# EAGLE board Open-Controller-Unitary_V1 (EAGLE 9.1.0), part 1 of 3
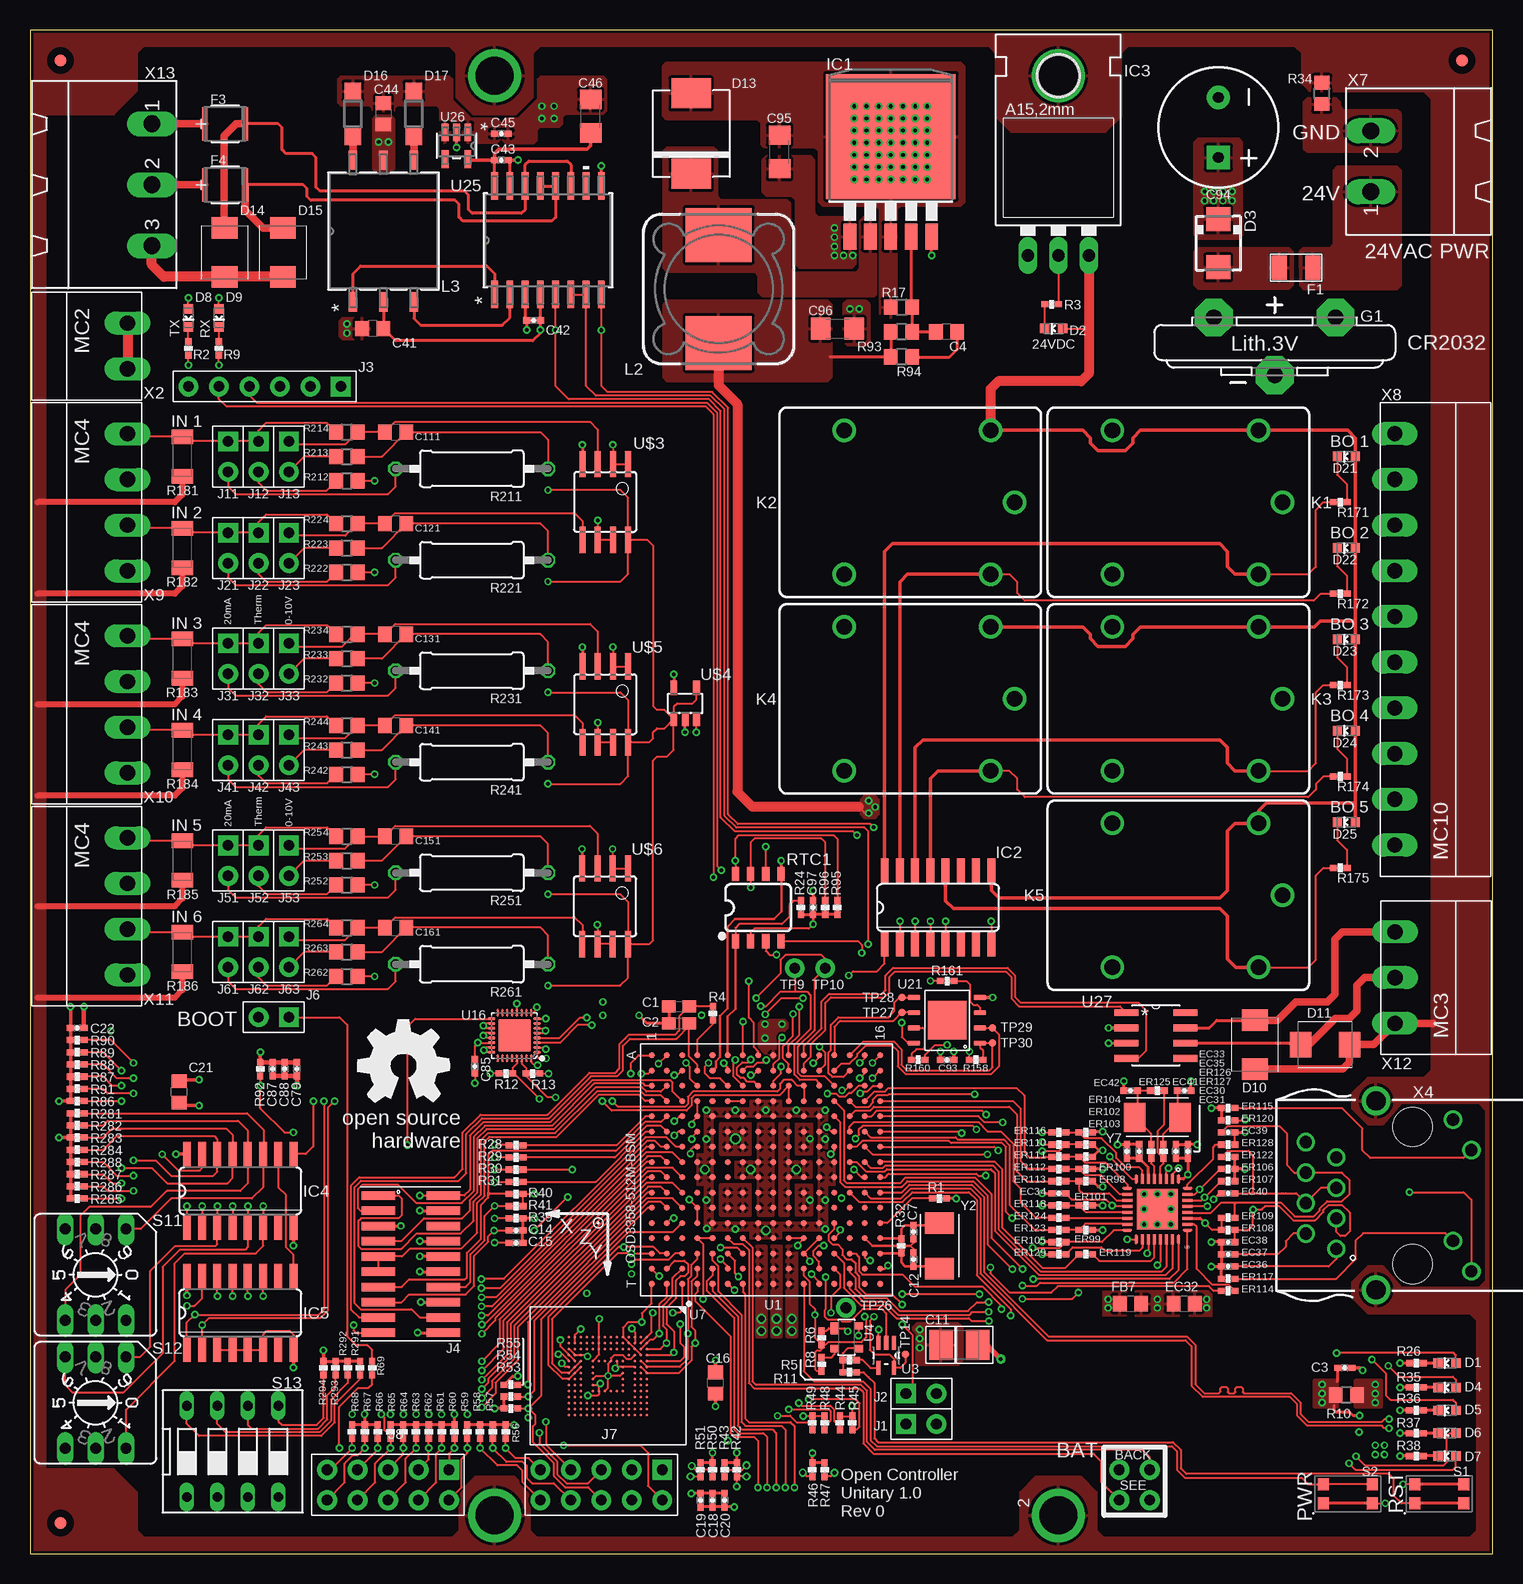
[diagram p7: board, top side]
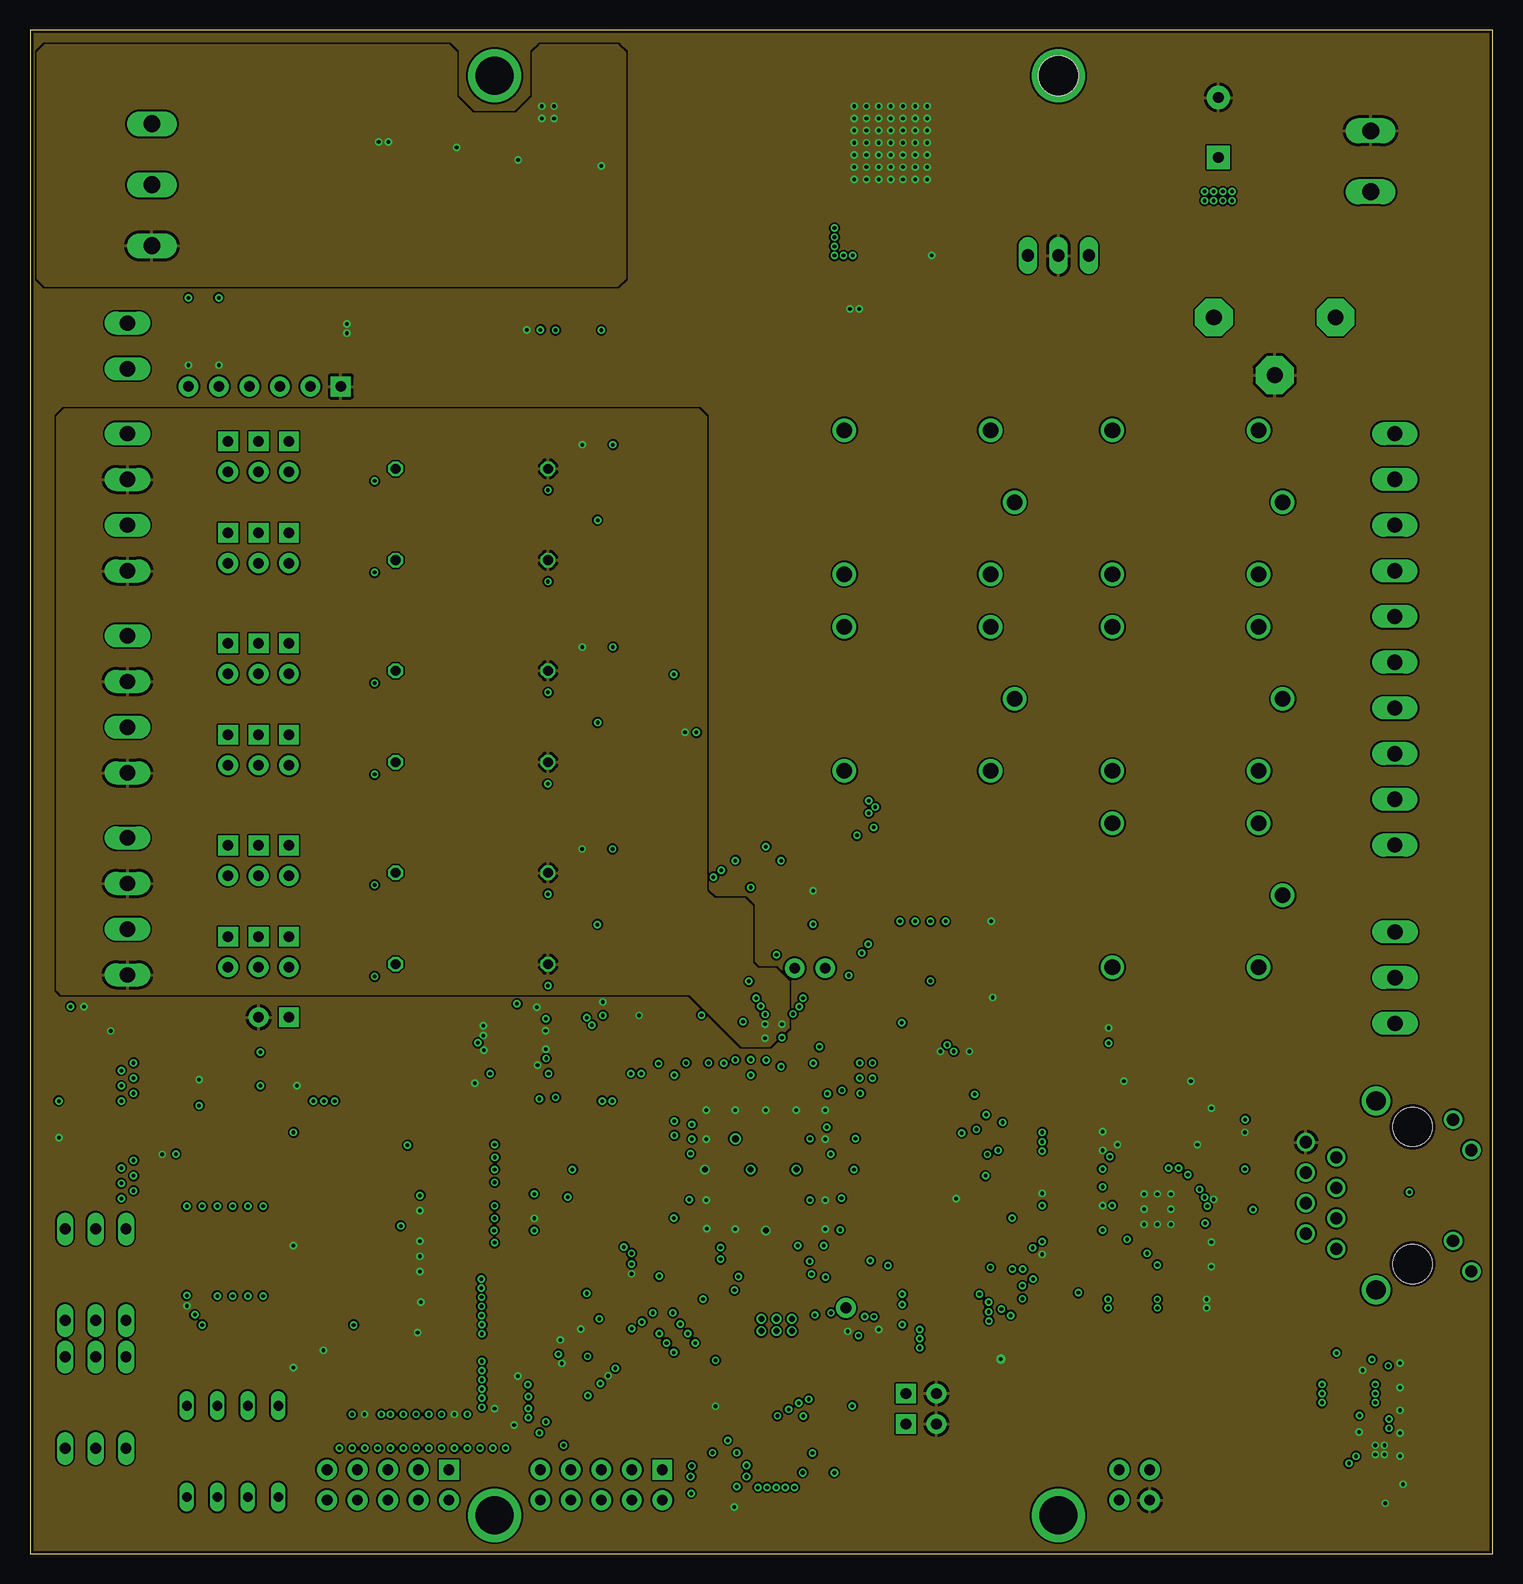
[diagram p8: board, inner layer Route2]
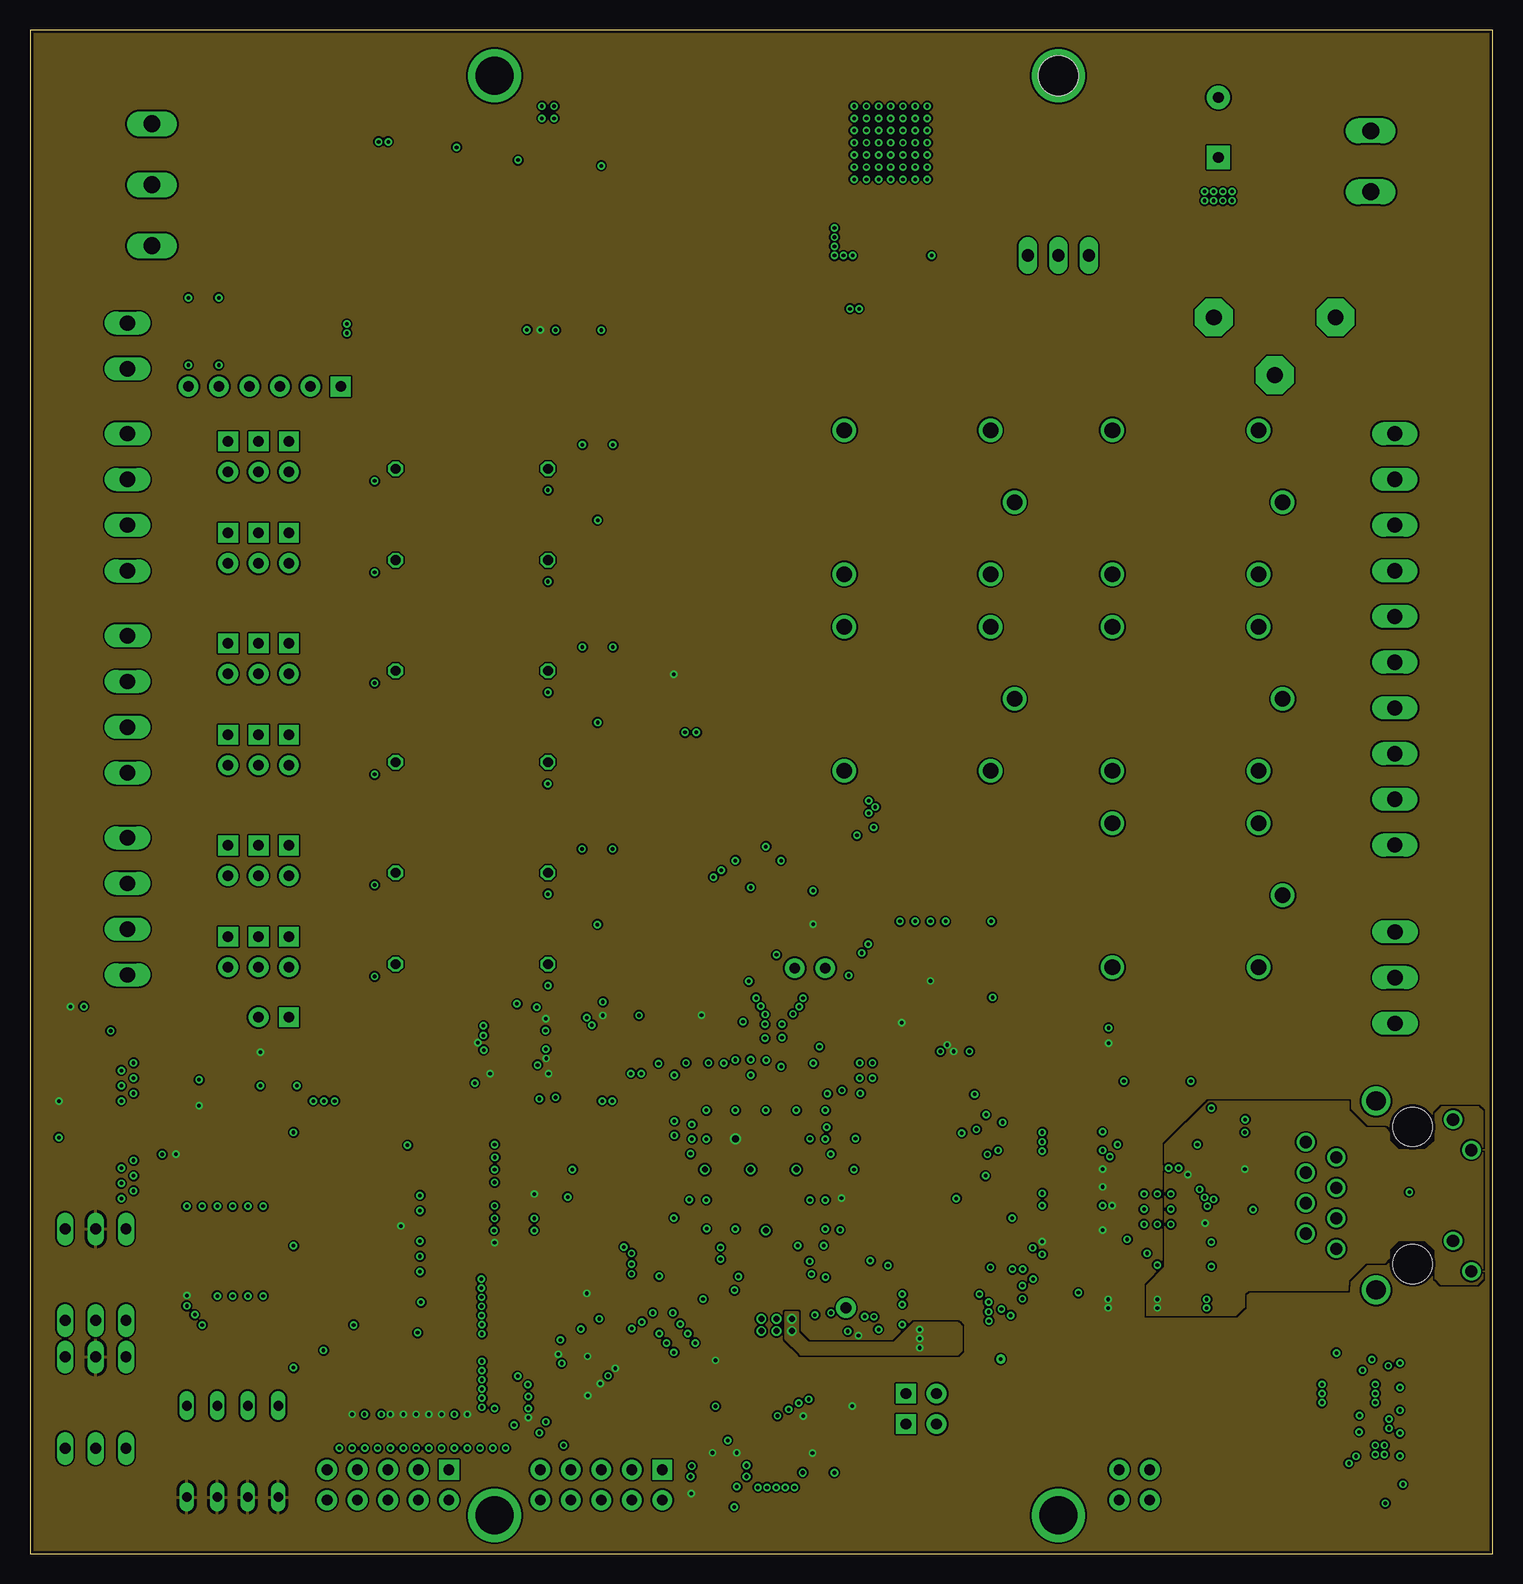
[diagram p9: board, inner layer Route15]
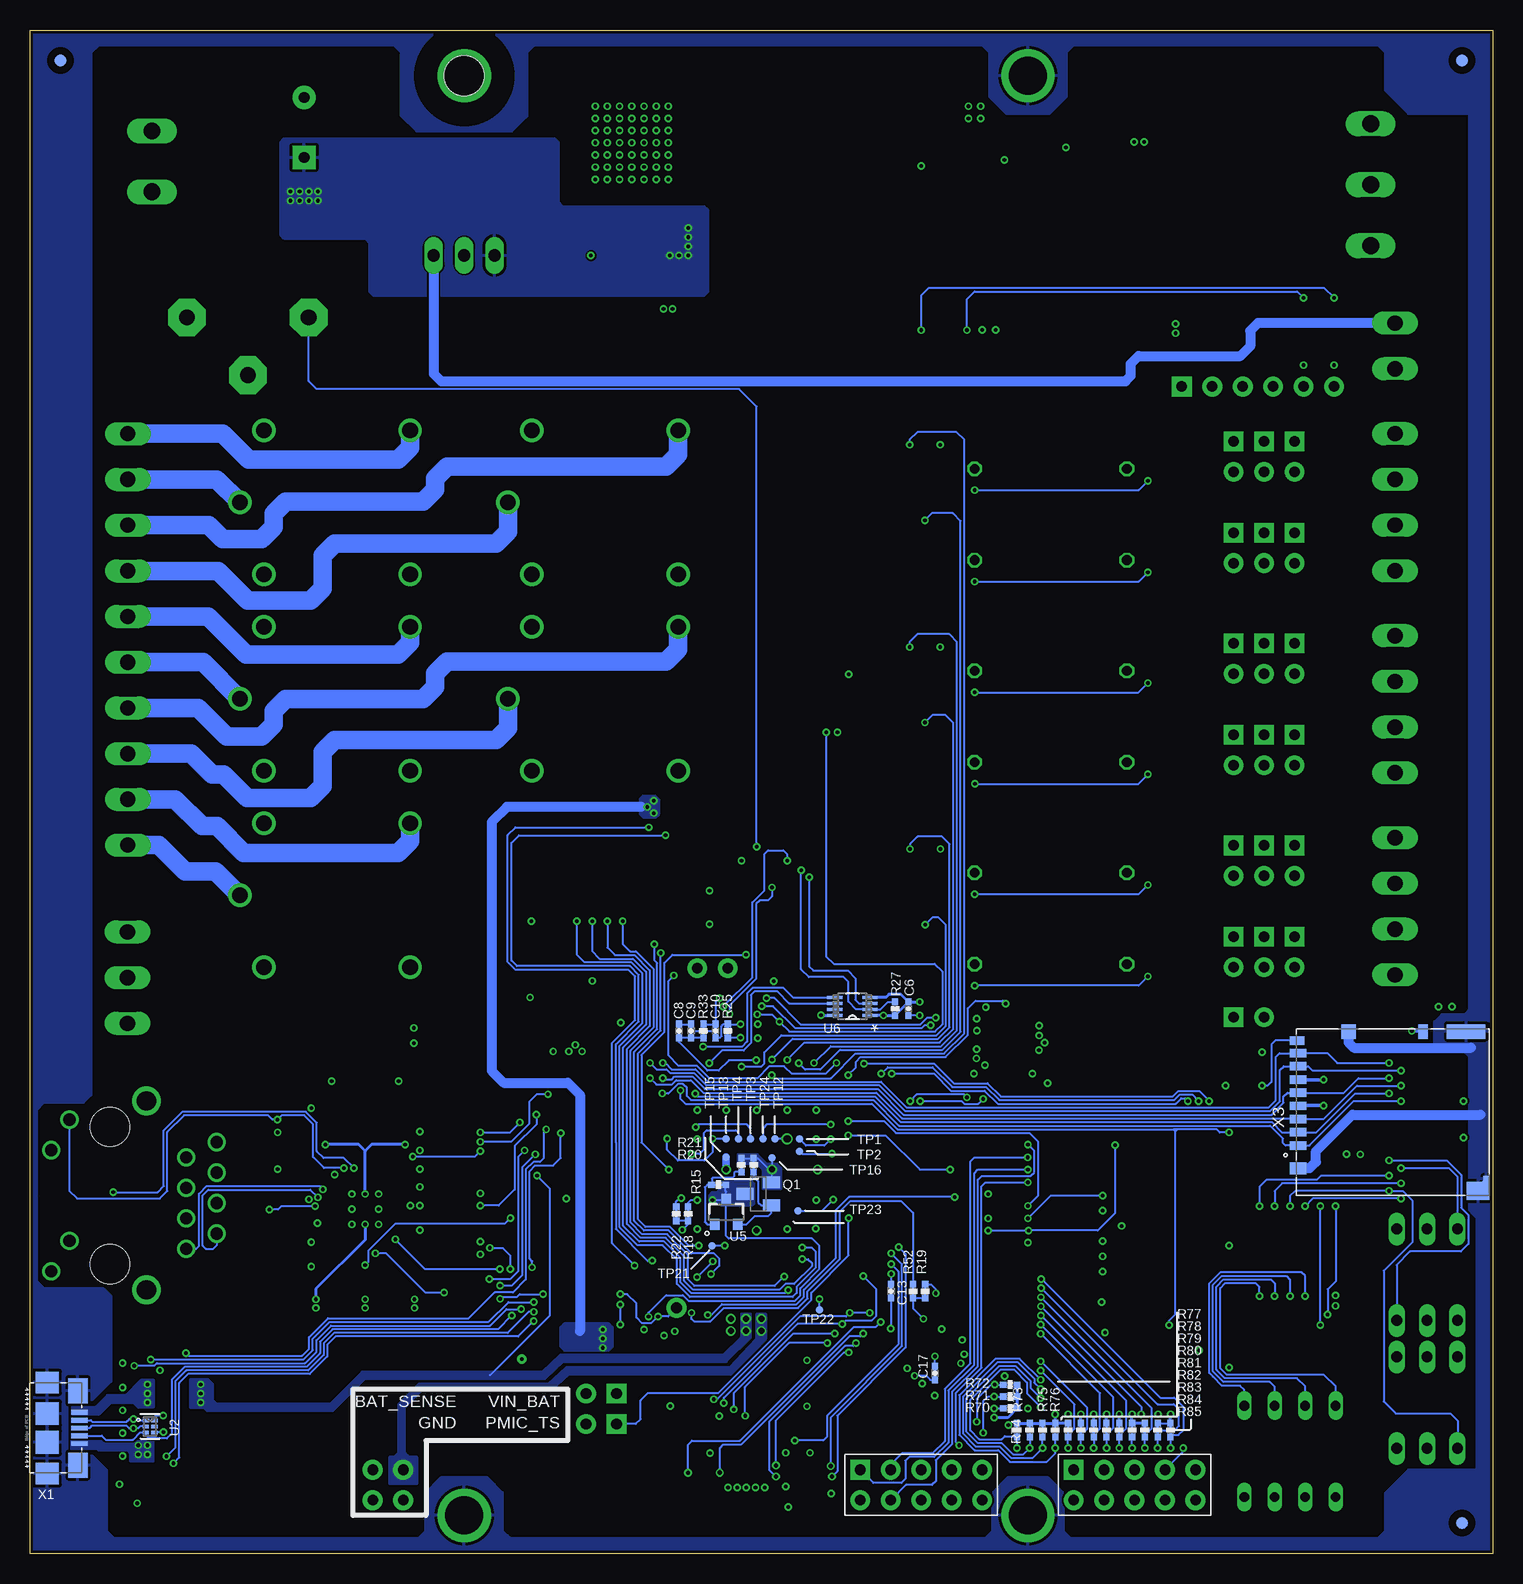
[diagram p10: board, bottom side, seen from below]

Size 121.92 x 127 mm. Coordinates in mm from the lower left corner, seen from the top.
Outline: 0,0 121.92,0 121.92,127 0,127 0,0
Copper layers (1*2*15*16): Top 0.035mm / dielectric 0.23mm / Route2 0.035mm / dielectric 0.93mm / Route15 0.035mm / dielectric 0.23mm / Bottom 0.035mm
Design rules "MF_Standard_4_Layer *": minimum track width 6mil, minimum drill 12mil, track to track 6mil, track to pad 6mil, pad to pad 6mil, via to via 6mil, smd to smd 0mil, copper to edge 10mil, drill to drill 10mil, minimum pad ring 6mil, minimum via ring 6mil, stop-mask expansion 2mil, vias tented up to drill 25mil, thermal gap 10mil
Net classes: 0 default: width 0.127 mm, drill 0.254 mm; 1 ground: width 0.152 mm, drill 0.254 mm, clearance 0.152 mm

## Footprints (pad centres in the part's own frame; a part is rotated, then mirrored left to right if it is on the bottom)
C0603 = smd 1.1 x 1: 1 -0.85,0; 2 0.85,0
C0402 = smd 0.61 x 0.508: 1 -0.559,0; 2 0.559,0
C0805 = smd 1.143 x 1.27: 1 -0.889,0; 2 0.889,0
B/3528-21R = smd 1.95 x 2.5: + 1.525,0; - -1.525,0
1206 = smd 1.6 x 1.8: 1 -1.4,0; 2 1.4,0
CPOL-RADIAL-5MM-10MM = drill 0.9 pad 1.93 square: + 2.5,0 | drill 0.9 pad 1.93: - -2.5,0
EIA-STD = smd 0.787 x 0.787: 1 -0.749,0; 2 0.749,0
SMA = smd 2 x 2: A 2,0; C -2,0
SMBJ = smd 1.78 x 2.16: A 2.04,0; C -2.03,0
SMC = smd 2.5 x 3.3: A 3.35,0; C -3.35,0
SOD123 = smd 1.4 x 1.4: A 1.9,0; C -1.9,0
R0402 = smd 0.61 x 0.508: 1 -0.559,0; 2 0.559,0
F1206W = smd 1.27 x 2.032: 1 -1.397,0; 2 1.397,0
FUS_MICROSMD010F_TYCO = smd 0.457 x 2.794: 1 -1.689,0; 2 1.689,0
FIDUCIAL_40MIL = smd 1.016 x 1.016: P$1 0,0
CR2032V = drill 1.321 pad 3.15 octagon: + -2.54,-5.08; +@1 -2.54,5.08; - 2.286,0
TO263-5 = smd 1.067 x 2.159: 1 -3.404,-5.791; 2 -1.702,-5.791; 3 0,-5.791; 4 1.702,-5.791; 5 3.404,-5.791 | smd 10.8 x 10.41: 6 0,2.54
SO16 = smd 0.66 x 2.032: 1 -4.445,-3.073; 2 -3.175,-3.073; 3 -1.905,-3.073; 4 -0.635,-3.073; 5 0.635,-3.073; 6 1.905,-3.073; 7 3.175,-3.073; 8 4.445,-3.073; 9 4.445,3.073; 10 3.175,3.073; 11 1.905,3.073; 12 0.635,3.073; 13 -0.635,3.073; 14 -1.905,3.073; 15 -3.175,3.073; 16 -4.445,3.073
78XXL = drill 1.016 long: GND 0,-3.81; IN -2.54,-3.81; OUT 2.54,-3.81 | hole 3.302: 0,11.176
H2-2.54 = drill 0.889 pad 1.651 square: 1 0,1.27 | drill 0.889 pad 1.651: 2 0,-1.27
H6-2.54 = drill 0.889 pad 1.651 square: 1 0,6.35 | drill 0.889 pad 1.651: 2 0,3.81; 3 0,1.27; 4 0,-1.27; 5 0,-3.81; 6 0,-6.35
CTI-JTAG = smd 2.794 x 0.711: 1 -2.705,5.715; 2 2.705,5.715; 3 -2.705,4.445; 4 2.705,4.445; 5 -2.705,3.175; 6 2.705,3.175; 7 -2.705,1.905; 8 2.705,1.905; 9 -2.705,0.635; 10 2.705,0.635; 11 -2.705,-0.635; 12 2.705,-0.635; 13 -2.705,-1.905; 14 2.705,-1.905; 15 -2.705,-3.175; 16 2.705,-3.175; 17 -2.705,-4.445; 18 2.705,-4.445; 19 -2.705,-5.715; 20 2.705,-5.715
H2X5-2.54 = drill 0.889 pad 1.651 square: 1 -1.27,5.08 | drill 0.889 pad 1.651: 2 1.27,5.08; 3 -1.27,2.54; 4 1.27,2.54; 5 -1.27,0; 6 1.27,0; 7 -1.27,-2.54; 8 1.27,-2.54; 9 -1.27,-5.08; 10 1.27,-5.08
JS-M = drill 1.3: 1 6.7,6; 2 6.7,-6; C 8.7,0; NC -5.5,-6; NO -5.5,6
MSS1260 = smd 5.5 x 4.5: 1 0,4.5; 2 0,-4.5
IND_78253_MC = smd 1.6 x 0.686: 1 -5.905,2.54; 2 -5.905,0; 3 -5.905,-2.54; 4 5.905,-2.54; 5 5.905,0; 6 5.905,2.54
MOUNTING_HOLE = drill 3.175 pad 4.445: P$1 0,0
SOT23-BEC = smd 1 x 1.4: B -0.95,-1.1; C 0,1.1; E 0.95,-1.1
R0805 = smd 1.143 x 1.27: 1 -0.889,0; 2 0.889,0
CT/CN1206 = smd 1.2 x 1.8: 1 -1.65,0; 2 1.65,0
0309/12 = drill 0.813 octagon: 1 -6.35,0; 2 6.35,0
SO08 = smd 0.6 x 1.2: 1 -1.905,-2.8; 2 -0.635,-2.8; 3 0.635,-2.8; 4 1.905,-2.8; 5 1.905,2.8; 6 0.635,2.8; 7 -0.635,2.8; 8 -1.905,2.8
SW4SMD_63X161LS = smd 0.9 x 1: 1 2.05,0.8; 2 2.05,-0.8; 3 -2.05,0.8; 4 -2.05,-0.8
P101 = drill 0.914 long: 1 3.81,-2.54; 2 -3.81,2.54; 4 3.81,2.54; 8 -3.81,-2.54; C 3.81,0; C1 -3.81,0
DS-04 = drill 0.813 long: 1 -3.81,-3.81; 2 -1.27,-3.81; 3 1.27,-3.81; 4 3.81,-3.81; 5 3.81,3.81; 6 1.27,3.81; 7 -1.27,3.81; 8 -3.81,3.81
TP_B0,65 = smd 0.635 x 0.635: TP 0,0
TESTPAD/W_HOLE_1X1 = drill 0.889 pad 1.651: P$1 0,0
OSD335X-BGA-256 = smd 0.5 x 0.5: A1 -9.525,-9.525; A2 -9.525,-8.255; A3 -9.525,-6.985; A4 -9.525,-5.715; A5 -9.525,-4.445; A6 -9.525,-3.175; A7 -9.525,-1.905; A8 -9.525,-0.635; A9 -9.525,0.635; A10 -9.525,1.905; A11 -9.525,3.175; A12 -9.525,4.445; A13 -9.525,5.715; A14 -9.525,6.985; A15 -9.525,8.255; A16 -9.525,9.525; B1 -8.255,-9.525; B2 -8.255,-8.255; B3 -8.255,-6.985; B4 -8.255,-5.715; B5 -8.255,-4.445; B6 -8.255,-3.175; B7 -8.255,-1.905; B8 -8.255,-0.635; B9 -8.255,0.635; B10 -8.255,1.905; B11 -8.255,3.175; B12 -8.255,4.445; B13 -8.255,5.715; B14 -8.255,6.985; B15 -8.255,8.255; B16 -8.255,9.525; C1 -6.985,-9.525; C2 -6.985,-8.255; C3 -6.985,-6.985; C4 -6.985,-5.715; C5 -6.985,-4.445; C6 -6.985,-3.175; C7 -6.985,-1.905; C8 -6.985,-0.635; C9 -6.985,0.635; C10 -6.985,1.905; C11 -6.985,3.175; C12 -6.985,4.445; C13 -6.985,5.715; C14 -6.985,6.985; C15 -6.985,8.255; C16 -6.985,9.525; D1 -5.715,-9.525; D2 -5.715,-8.255; D3 -5.715,-6.985; D4 -5.715,-5.715; D5 -5.715,-4.445; D6 -5.715,-3.175; D7 -5.715,-1.905; D8 -5.715,-0.635; D9 -5.715,0.635; D10 -5.715,1.905; D11 -5.715,3.175; D12 -5.715,4.445; D13 -5.715,5.715; D14 -5.715,6.985; D15 -5.715,8.255; D16 -5.715,9.525; E1 -4.445,-9.525; E2 -4.445,-8.255; E3 -4.445,-6.985; E4 -4.445,-5.715; E5 -4.445,-4.445; E6 -4.445,-3.175; E7 -4.445,-1.905; E8 -4.445,-0.635; E9 -4.445,0.635; E10 -4.445,1.905; E11 -4.445,3.175; E12 -4.445,4.445; E13 -4.445,5.715; E14 -4.445,6.985; E15 -4.445,8.255; E16 -4.445,9.525; F1 -3.175,-9.525; F2 -3.175,-8.255; F3 -3.175,-6.985; F4 -3.175,-5.715; F5 -3.175,-4.445; F6 -3.175,-3.175; F7 -3.175,-1.905; F8 -3.175,-0.635; F9 -3.175,0.635; F10 -3.175,1.905; F11 -3.175,3.175; F12 -3.175,4.445; F13 -3.175,5.715; F14 -3.175,6.985; F15 -3.175,8.255; F16 -3.175,9.525; G1 -1.905,-9.525; G2 -1.905,-8.255; G3 -1.905,-6.985; G4 -1.905,-5.715; G5 -1.905,-4.445; G6 -1.905,-3.175; G7 -1.905,-1.905; G8 -1.905,-0.635; G9 -1.905,0.635; G10 -1.905,1.905; G11 -1.905,3.175; G12 -1.905,4.445; G13 -1.905,5.715; G14 -1.905,6.985; G15 -1.905,8.255; G16 -1.905,9.525; H1 -0.635,-9.525; H2 -0.635,-8.255; H3 -0.635,-6.985; H4 -0.635,-5.715; H5 -0.635,-4.445; H6 -0.635,-3.175; H7 -0.635,-1.905; H8 -0.635,-0.635; H9 -0.635,0.635; H10 -0.635,1.905; H11 -0.635,3.175; H12 -0.635,4.445; H13 -0.635,5.715; H14 -0.635,6.985; H15 -0.635,8.255; H16 -0.635,9.525; J1 0.635,-9.525; J2 0.635,-8.255; J3 0.635,-6.985; J4 0.635,-5.715; J5 0.635,-4.445; J6 0.635,-3.175; J7 0.635,-1.905; J8 0.635,-0.635; J9 0.635,0.635; J10 0.635,1.905; J11 0.635,3.175; J12 0.635,4.445; J13 0.635,5.715; J14 0.635,6.985; J15 0.635,8.255; J16 0.635,9.525; K1 1.905,-9.525; K2 1.905,-8.255; K3 1.905,-6.985; K4 1.905,-5.715; K5 1.905,-4.445; K6 1.905,-3.175; K7 1.905,-1.905; K8 1.905,-0.635; K9 1.905,0.635; K10 1.905,1.905; K11 1.905,3.175; K12 1.905,4.445; K13 1.905,5.715; K14 1.905,6.985; K15 1.905,8.255; K16 1.905,9.525; L1 3.175,-9.525; L2 3.175,-8.255; L3 3.175,-6.985; L4 3.175,-5.715; L5 3.175,-4.445; L6 3.175,-3.175; L7 3.175,-1.905; L8 3.175,-0.635; L9 3.175,0.635; L10 3.175,1.905; L11 3.175,3.175; L12 3.175,4.445; L13 3.175,5.715; L14 3.175,6.985; L15 3.175,8.255; L16 3.175,9.525; M1 4.445,-9.525; M2 4.445,-8.255; M3 4.445,-6.985; M4 4.445,-5.715; M5 4.445,-4.445; M6 4.445,-3.175; M7 4.445,-1.905; M8 4.445,-0.635; M9 4.445,0.635; M10 4.445,1.905; M11 4.445,3.175; M12 4.445,4.445; M13 4.445,5.715; M14 4.445,6.985; M15 4.445,8.255; M16 4.445,9.525; N1 5.715,-9.525; N2 5.715,-8.255; N3 5.715,-6.985; N4 5.715,-5.715; N5 5.715,-4.445; N6 5.715,-3.175; N7 5.715,-1.905; N8 5.715,-0.635; N9 5.715,0.635; N10 5.715,1.905; N11 5.715,3.175; N12 5.715,4.445; N13 5.715,5.715; N14 5.715,6.985; N15 5.715,8.255; N16 5.715,9.525; P1 6.985,-9.525; P2 6.985,-8.255; P3 6.985,-6.985; P4 6.985,-5.715; P5 6.985,-4.445; P6 6.985,-3.175; P7 6.985,-1.905; P8 6.985,-0.635; P9 6.985,0.635; P10 6.985,1.905; P11 6.985,3.175; P12 6.985,4.445; P13 6.985,5.715; P14 6.985,6.985; P15 6.985,8.255; P16 6.985,9.525; R1 8.255,-9.525; R2 8.255,-8.255; R3 8.255,-6.985; R4 8.255,-5.715; R5 8.255,-4.445; R6 8.255,-3.175; R7 8.255,-1.905; R8 8.255,-0.635; R9 8.255,0.635; R10 8.255,1.905; R11 8.255,3.175; R12 8.255,4.445; R13 8.255,5.715; R14 8.255,6.985; R15 8.255,8.255; R16 8.255,9.525; T1 9.525,-9.525; T2 9.525,-8.255; T3 9.525,-6.985; T4 9.525,-5.715; T5 9.525,-4.445; T6 9.525,-3.175; T7 9.525,-1.905; T8 9.525,-0.635; T9 9.525,0.635; T10 9.525,1.905; T11 9.525,3.175; T12 9.525,4.445; T13 9.525,5.715; T14 9.525,6.985; T15 9.525,8.255; T16 9.525,9.525
DRY6 = smd 0.55 x 0.3: 1 -0.355,0.5 | smd 0.52 x 0.3: 2 -0.37,0; 3 -0.37,-0.5; 4 0.37,-0.5; 5 0.37,0; 6 0.37,0.5
DCK5 = smd 1.168 x 0.356: 1 -1.041,0.65; 2 -1.041,0; 3 -1.041,-0.65; 4 1.041,-0.65; 5 1.041,0.65
SOT143-R = smd 1 x 0.7: 1 -0.75,-1 | smd 0.6 x 0.7: 2 0.95,-1; 3 0.95,1; 4 -0.95,1
SOT23-3 = smd 0.8 x 0.9: 1 -0.95,-1; 2 0.95,-1; 3 0,1.1
DCU8 = smd 1.27 x 0.254: 1 -1.473,0.749; 2 -1.473,0.249; 3 -1.473,-0.249; 4 -1.473,-0.749; 5 1.473,-0.749; 6 1.473,-0.249; 7 1.473,0.249; 8 1.473,0.749
MICRON_EMMC_153 = smd 0.245 x 0.245: A1 -3.25,3.25; A2 -2.75,3.25; A3 -2.25,3.25; A4 -1.75,3.25; A5 -1.25,3.25; A6 -0.75,3.25; A7 -0.25,3.25; A8 0.25,3.25; A9 0.75,3.25; A10 1.25,3.25; A11 1.75,3.25; A12 2.25,3.25; A13 2.75,3.25; A14 3.25,3.25; B1 -3.25,2.75; B2 -2.75,2.75; B3 -2.25,2.75; B4 -1.75,2.75; B5 -1.25,2.75; B6 -0.75,2.75; B7 -0.25,2.75; B8 0.25,2.75; B9 0.75,2.75; B10 1.25,2.75; B11 1.75,2.75; B12 2.25,2.75; B13 2.75,2.75; B14 3.25,2.75; C1 -3.25,2.25; C2 -2.75,2.25; C3 -2.25,2.25; C4 -1.75,2.25; C5 -1.25,2.25; C6 -0.75,2.25; C7 -0.25,2.25; C8 0.25,2.25; C9 0.75,2.25; C10 1.25,2.25; C11 1.75,2.25; C12 2.25,2.25; C13 2.75,2.25; C14 3.25,2.25; D1 -3.25,1.75; D2 -2.75,1.75; D3 -2.25,1.75; D4 -1.75,1.75; D12 2.25,1.75; D13 2.75,1.75; D14 3.25,1.75; E1 -3.25,1.25; E2 -2.75,1.25; E3 -2.25,1.25; E5 -1.25,1.25; E6 -0.75,1.25; E7 -0.25,1.25; E8 0.25,1.25; E9 0.75,1.25; E10 1.25,1.25; E12 2.25,1.25; E13 2.75,1.25; E14 3.25,1.25; F1 -3.25,0.75; F2 -2.75,0.75; F3 -2.25,0.75; F5 -1.25,0.75; F10 1.25,0.75; F12 2.25,0.75; F13 2.75,0.75; F14 3.25,0.75; G1 -3.25,0.25; G2 -2.75,0.25; G3 -2.25,0.25; G5 -1.25,0.25; G10 1.25,0.25; G12 2.25,0.25; G13 2.75,0.25; G14 3.25,0.25; H1 -3.25,-0.25; H2 -2.75,-0.25; H3 -2.25,-0.25; H5 -1.25,-0.25; H10 1.25,-0.25; H12 2.25,-0.25; H13 2.75,-0.25; H14 3.25,-0.25; J1 -3.25,-0.75; J2 -2.75,-0.75; J3 -2.25,-0.75; J5 -1.25,-0.75; J10 1.25,-0.75; J12 2.25,-0.75; J13 2.75,-0.75; J14 3.25,-0.75; K1 -3.25,-1.25; K2 -2.75,-1.25; K3 -2.25,-1.25; K5 -1.25,-1.25; K6 -0.75,-1.25; K7 -0.25,-1.25; K8 0.25,-1.25; K9 0.75,-1.25; K10 1.25,-1.25; K12 2.25,-1.25; K13 2.75,-1.25; K14 3.25,-1.25; L1 -3.25,-1.75; L2 -2.75,-1.75; L3 -2.25,-1.75; L12 2.25,-1.75; L13 2.75,-1.75; L14 3.25,-1.75; M1 -3.25,-2.25; M2 -2.75,-2.25; M3 -2.25,-2.25; M4 -1.75,-2.25; M5 -1.25,-2.25; M6 -0.75,-2.25; M7 -0.25,-2.25; M8 0.25,-2.25; M9 0.75,-2.25; M10 1.25,-2.25; M11 1.75,-2.25; M12 2.25,-2.25; M13 2.75,-2.25; M14 3.25,-2.25; N1 -3.25,-2.75; N2 -2.75,-2.75; N3 -2.25,-2.75; N4 -1.75,-2.75; N5 -1.25,-2.75; N6 -0.75,-2.75; N7 -0.25,-2.75; N8 0.25,-2.75; N9 0.75,-2.75; N10 1.25,-2.75; N11 1.75,-2.75; N12 2.25,-2.75; N13 2.75,-2.75; N14 3.25,-2.75; P1 -3.25,-3.25; P2 -2.75,-3.25; P3 -2.25,-3.25; P4 -1.75,-3.25; P5 -1.25,-3.25; P6 -0.75,-3.25; P7 -0.25,-3.25; P8 0.25,-3.25; P9 0.75,-3.25; P10 1.25,-3.25; P11 1.75,-3.25; P12 2.25,-3.25; P13 2.75,-3.25; P14 3.25,-3.25
LAN8710A-QFN32 = smd 0.254 x 0.838: 1 -1.751,-2.515; 2 -1.251,-2.515; 3 -0.751,-2.515; 4 -0.251,-2.515; 5 0.251,-2.515; 6 0.751,-2.515; 7 1.251,-2.515; 8 1.751,-2.515; 17 1.751,2.515; 18 1.251,2.515; 19 0.751,2.515; 20 0.251,2.515; 21 -0.251,2.515; 22 -0.751,2.515; 23 -1.251,2.515; 24 -1.751,2.515 | smd 0.838 x 0.254: 9 2.515,-1.751; 10 2.515,-1.251; 11 2.515,-0.751; 12 2.515,-0.251; 13 2.515,0.251; 14 2.515,0.751; 15 2.515,1.251; 16 2.515,1.751; 25 -2.515,1.751; 26 -2.515,1.251; 27 -2.515,0.751; 28 -2.515,0.251; 29 -2.515,-0.251; 30 -2.515,-0.751; 31 -2.515,-1.251; 32 -2.515,-1.751 | smd 3.404 x 3.404: 33 0,0
QFN32-0.4-4X4MM = smd 0.6 x 0.2: 1 -1.9,1.4; 2 -1.9,1; 3 -1.9,0.6; 4 -1.9,0.2; 5 -1.9,-0.2; 6 -1.9,-0.6; 7 -1.9,-1; 8 -1.9,-1.4; 17 1.9,-1.4; 18 1.9,-1; 19 1.9,-0.6; 20 1.9,-0.2; 21 1.9,0.2; 22 1.9,0.6; 23 1.9,1; 24 1.9,1.4 | smd 0.2 x 0.6: 9 -1.4,-1.9; 10 -1,-1.9; 11 -0.6,-1.9; 12 -0.2,-1.9; 13 0.2,-1.9; 14 0.6,-1.9; 15 1,-1.9; 16 1.4,-1.9; 25 1.4,1.9; 26 1,1.9; 27 0.6,1.9; 28 0.2,1.9; 29 -0.2,1.9; 30 -0.6,1.9; 31 -1,1.9; 32 -1.4,1.9 | smd 2.7 x 2.7: 33 0,0
W-PDFN-8 = smd 1.05 x 0.45: 1 -2.75,1.905; 2 -2.75,0.635; 3 -2.75,-0.635; 4 -2.75,-1.905; 5 2.75,-1.905; 6 2.75,-0.635; 7 2.75,0.635; 8 2.75,1.905 | smd 3.2 x 3.2: PAD 0,0
DW16 = smd 2.311 x 0.559: 1 -4.521,4.445; 2 -4.521,3.175; 3 -4.521,1.905; 4 -4.521,0.635; 5 -4.521,-0.635; 6 -4.521,-1.905; 7 -4.521,-3.175; 8 -4.521,-4.445; 9 4.521,-4.445; 10 4.521,-3.175; 11 4.521,-1.905; 12 4.521,-0.635; 13 4.521,0.635; 14 4.521,1.905; 15 4.521,3.175; 16 4.521,4.445
DBV5 = smd 1.473 x 0.559: 1 -1.118,0.95; 2 -1.118,0; 3 -1.118,-0.95; 4 1.118,-0.95; 5 1.118,0.95
BEAGLEBONE_BLUE_D8 = smd 1.981 x 0.559: 1 -2.464,1.905; 2 -2.464,0.635; 3 -2.464,-0.635; 4 -2.464,-1.905; 5 2.464,-1.905; 6 2.464,-0.635; 7 2.464,0.635; 8 2.464,1.905
SOIC8 = smd 0.5 x 2.2: 1 -1.905,-3.154; 2 -0.645,-3.154; 3 0.625,-3.154; 4 1.895,-3.154; 5 1.905,3.154; 6 0.635,3.154; 7 -0.635,3.154; 8 -1.905,3.154
SOT23-5 = smd 0.55 x 1.2: 1 -0.95,-1.3; 2 0,-1.3; 3 0.95,-1.3; 4 0.95,1.3; 5 -0.95,1.3
10118192-0001LF(MICRO-USB-B-AMPHENOL-FCI) = smd 1.8 x 1.9: CGND1 -3.8,0; CGND4 3.8,0 | smd 1.9 x 1.9: CGND2 -1.2,0; CGND3 1.2,0 | smd 2.1 x 1.6: CGND5 3.1,2.55; CGND6 -3.1,2.55 | smd 0.4 x 1.35: D+ 0,2.675; D- -0.65,2.675; GND 1.3,2.675; ID 0.65,2.675; VBUS -1.3,2.675
MC2 = drill 1.27 long: 1 -1.905,0; 2 1.905,0
DM3BT-DSF-PEJS = smd 0.7 x 1.4: 1 -3.2,15.95; 2 -2.1,15.95; 3 -1,15.95; 4 0.1,15.95; 5 1.2,15.95; 6 2.3,15.95; 7 3.4,15.95; 8 4.5,15.95 | smd 0.7 x 1.2: CD 5.55,16.05 | smd 0.5 x 0.5: CGND1 -6,0.25 | smd 1.5 x 1.9: CGND2 -7,0.95 | smd 0.21 x 0.21 rotated 45: CGND3 -6.25,0.5 | smd 1 x 1.4: CGND4 -5.1,15.95 | smd 1.2 x 1.2: CGND5 6.3,11.75 | smd 1.2 x 3.2: CGND6 6.3,1.95 | smd 1.2 x 0.8: GND 6.3,5.55
SI-50170 = drill 1.016 pad 1.524: 1 4.445,-6.413; 2 3.175,-8.954; 3 1.905,-6.413; 4 0.635,-8.954; 5 -0.635,-6.413; 6 -1.905,-8.954; 7 -3.175,-6.413; 8 -4.445,-8.954; A1 -6.325,3.315; A2 3.785,3.315; C1 -3.785,4.839; C2 6.325,4.839 | drill 1.6 pad 2.286: S1 -7.874,-3.111; S2 7.874,-3.111 | hole 3.251: -5.715,-0.064; 5.715,-0.064
MSTBA2 = drill 1.397 long: 1 -2.54,5.08; 2 2.54,5.08
MC10 = drill 1.27 long: 1 -17.145,0; 2 -13.335,0; 3 -9.525,0; 4 -5.715,0; 5 -1.905,0; 6 1.905,0; 7 5.715,0; 8 9.525,0; 9 13.335,0; 10 17.145,0
MC4 = drill 1.27 long: 1 -5.715,0; 2 -1.905,0; 3 1.905,0; 4 5.715,0
MC3 = drill 1.27 long: 1 -3.81,0; 2 0,0; 3 3.81,0
MSTBA3 = drill 1.397 long: 1 -5.08,5.08; 2 0,5.08; 3 5.08,5.08
CRYSTAL-TXC-7A = smd 1.788 x 2.413: P$1 1.9,0; P$2 -1.9,0

## Placement (x,y rotation side)
C1  DNI  [C0603]  54.1,45.59 0 top
C2  DNI  [C0603]  54.1,44.2 0 top
C3  0.1uF, 6.3V  [C0402]  109.6,15.49 0 top
C4  330pF, DNI  [C0805]  76.4,101.83 180 top
C6  0.1uF, 6.3V  [C0402]  48.69,45.42 270 bottom
C7  18pF, 50V  [C0402]  73.66,26.8 270 top
C8  1nF  [C0402]  67.82,43.56 90 bottom
C9  0.1uF, 6.3V  [C0402]  66.8,43.56 90 bottom
C10  0.1uF, 6.3V  [C0402]  64.77,43.56 270 bottom
C11  220uF, 6.3V  [B/3528-21R]  77.47,17.4 180 top
C12  18pF, 50V  [C0402]  73.66,24.51 90 top
C13  2.2uF, 6.3V  [C0402]  50.14,21.87 270 bottom
C14  0.1uF, 6.3V  [C0402]  40.51,26.92 0 top
C15  0.1uF, 6.3V  [C0402]  40.51,25.91 0 top
C16  10uF, 10V  [C0805]  57.15,14.22 90 top
C17  0.1uF, 6.3V  [C0402]  46.48,15.04 90 bottom
C18  0.1uF, 6.3V  [C0402]  56.9,4.45 90 top
C19  0.1uF, 6.3V  [C0402]  55.88,4.45 90 top
C20  0.1uF, 6.3V  [C0402]  57.91,4.45 90 top
C21  10uF, 10V  [C0805]  12.45,38.48 90 top
C22  0.1uF, 6.3V  [C0402]  3.94,43.81 0 top
C41  10uF, 16V  [C0805]  28.57,102.11 180 top
C42  0.1uF, 16V  [C0402]  41.99,102.79 180 top
C43  0.1uF, 16V  [C0402]  39.29,116.15 0 top
C44  10uF, 16V  [C0805]  29.46,120.02 270 top
C45  0.1uF, 16V  [C0402]  39.29,118.36 0 top
C46  4.7uF  [1206]  46.74,119.81 90 top
C79  0.1uF, 6.3V  [C0402]  22.25,40.39 270 top
C85  2200pF, 6.3V  [C0402]  37.08,40.61 270 top
C87  2200pF, 6.3V  [C0402]  20.22,40.39 270 top
C88  2200pF, 6.3V  [C0402]  21.23,40.39 270 top
C93  0.1uF, 6.3V  [C0402]  76.45,41.15 180 top
C94  1mF  [CPOL-RADIAL-5MM-10MM]  99.06,118.87 270 top
C95  4.7uF  [1206]  62.48,116.84 90 top
C96  4.7uF  [1206]  67.31,102.11 0 top
C97  0.1uF, 6.3V  [C0402]  65.28,53.85 90 top
C111  1uF  [C0805]  30.48,93.47 0 top
C121  1uF  [C0805]  30.48,85.85 0 top
C131  1uF  [C0805]  30.48,76.63 0 top
C141  1uF  [C0805]  30.48,69.01 0 top
C151  1uF  [C0805]  30.48,59.79 0 top
C161  1uF  [C0805]  30.48,52.17 0 top
D1  LTST-C191KFKT  [EIA-STD]  118.11,15.88 180 top
D2  LTST-C191KFKT  [EIA-STD]  85.34,102.11 180 top
D3  S1D  [SMA]  99.06,109.22 270 top
D4  LTST-C191KGKT  [EIA-STD]  118.11,13.84 180 top
D5  LTST-C191KGKT  [EIA-STD]  118.11,11.94 180 top
D6  LTST-C191KGKT  [EIA-STD]  118.11,10.03 180 top
D7  LTST-C191KGKT  [EIA-STD]  118.11,8.13 180 top
D8  LTST-C191KGKT  [EIA-STD]  13.21,103 270 top
D9  LTST-C191KFKT  [EIA-STD]  15.75,103 270 top
D10  SMBJ7.0CA  [SMBJ]  102.11,42.42 270 top
D11  SMBJ7.0CA  [SMBJ]  107.95,42.42 0 top
D13  B550C-13-F  [SMC]  55.12,118.36 90 top
D14  SMBJ12CA  [SMBJ]  16.23,108.46 270 top
D15  SMBJ12CA  [SMBJ]  21.08,108.46 270 top
D16  MBR0520LT  [SOD123]  26.92,120.02 270 top
D17  MBR0520LT  [SOD123]  32,120.02 270 top
D21  LTST-C191KFKT  [EIA-STD]  109.73,91.44 180 top
D22  LTST-C191KFKT  [EIA-STD]  109.73,83.82 180 top
D23  LTST-C191KFKT  [EIA-STD]  109.73,76.2 180 top
D24  LTST-C191KFKT  [EIA-STD]  109.73,68.58 180 top
D25  LTST-C191KFKT  [EIA-STD]  109.73,60.96 180 top
EC30  0.1uF, 6.3V  [C0402]  95.5,33.53 90 top
EC31  0.1uF, 6.3V  [C0402]  96.52,33.53 90 top
EC32  10uF, 10V  [C0805]  96.22,20.83 0 top
EC33  1uF, 10V  [C0402]  91.44,33.53 90 top
EC34  0.1uF, 6.3V  [C0402]  85.78,30.02 180 top
EC35  470pF, 6.3V  [C0402]  92.46,33.53 90 top
EC36  15pF, DNI  [C0402]  99.87,23.93 180 top
EC37  15pF, DNI  [C0402]  99.87,24.94 180 top
EC38  15pF, DNI  [C0402]  99.87,25.96 180 top
EC39  15pF, DNI  [C0402]  99.87,35.1 0 top
EC40  0.022uF, 10V  [C0402]  99.87,30.02 180 top
EC41  30pF, 50V  [C0402]  96.22,38.58 0 top
EC42  30pF, 50V  [C0402]  91.74,38.58 180 top
ER98  1.5K, 1%  [R0402]  88.01,31.04 180 top
ER99  1.5K, 1%  [R0402]  88.01,26.97 180 top
ER100  1.5K, 1%  [R0402]  88.01,32.05 180 top
ER101  10K, 1%  [R0402]  88.01,29.01 0 top
ER102  10K, 1%  [R0402]  88.01,34.09 0 top
ER103  10K, 1%  [R0402]  88.01,33.07 0 top
ER104  10K, 1%  [R0402]  88.01,35.1 0 top
ER105  1.5K, 1%  [R0402]  85.78,25.96 0 top
ER106  49.9, 1%  [R0402]  99.87,32.05 180 top
ER107  49.9, 1%  [R0402]  99.87,31.04 180 top
ER108  49.9, 1%  [R0402]  99.87,26.97 0 top
ER109  49.9, 1%  [R0402]  99.87,27.99 0 top
ER110  100, 1%  [R0402]  85.78,34.09 180 top
ER111  100, 1%  [R0402]  85.78,33.07 180 top
ER112  100, 1%  [R0402]  85.78,32.05 180 top
ER113  100, 1%  [R0402]  85.78,31.04 180 top
ER114  100, 1%  [R0402]  99.87,21.89 180 top
ER115  470, 1%  [R0402]  99.87,37.13 0 top
ER116  100, 1%  [R0402]  85.78,35.1 180 top
ER117  470, 1%  [R0402]  99.87,22.91 0 top
ER118  100, 1%  [R0402]  85.78,29.01 180 top
ER119  100, 1%  [R0402]  88.01,24.94 180 top
ER120  10K, 1%  [R0402]  99.87,36.12 0 top
ER122  0, 1%  [R0402]  99.87,33.07 180 top
ER123  100, 1%  [R0402]  85.78,26.97 180 top
ER124  100, 1%  [R0402]  85.78,27.99 180 top
ER125  1M, 1%, DNI  [R0402]  93.98,38.58 180 top
ER126  0, 1%  [R0402]  93.47,33.53 90 top
ER127  10, 1%  [R0402]  94.49,33.53 90 top
ER128  12.1K, 1%  [R0402]  99.87,34.09 180 top
ER129  10K, 1%  [R0402]  85.78,24.94 180 top
F1  4A Fuse  [F1206W]  105.54,107.19 180 top
F3  MICROSMD010F-2  [FUS_MICROSMD010F_TYCO]  16.26,119.18 0 top
F4  MICROSMD010F-2  [FUS_MICROSMD010F_TYCO]  16.26,114.1 0 top
FB7  150ohm, 800mA  [C0805]  91.74,20.83 0 top
FUD1  FIDUCIAL  [FIDUCIAL_40MIL]  2.54,124.46 180 top
FUD2  FIDUCIAL  [FIDUCIAL_40MIL]  2.54,2.54 180 top
FUD3  FIDUCIAL  [FIDUCIAL_40MIL]  119.38,124.46 180 top
FUD4  FIDUCIAL  [FIDUCIAL_40MIL]  2.54,2.54 270 bottom
FUD5  FIDUCIAL  [FIDUCIAL_40MIL]  119.38,124.46 270 bottom
FUD6  FIDUCIAL  [FIDUCIAL_40MIL]  2.54,124.46 270 bottom
G1  CR2032V  [CR2032V]  103.76,100.51 270 top
IC1  [TO263-5]  71.75,115.57 0 top
IC2  ULN2003AD  [SO16]  75.69,53.85 0 top
IC3  L7824CT  [78XXL]  85.72,112.01 0 top
IC4  74HC165D  [SO16]  17.53,30.23 0 top
IC5  74HC165D  [SO16]  17.53,20.07 0 top
J1  [H2-2.54]  74.3,10.79 90 top
J2  [H2-2.54]  74.3,13.34 90 top
J3  6p-2.54  [H6-2.54]  19.56,97.28 270 top
J4  CTI-JTAG  [CTI-JTAG]  31.75,24.13 0 top
J6  [H2-2.54]  20.32,44.7 270 top
J7  TH-2X5  [H2X5-2.54]  47.62,5.71 270 top
J8  TH-2X5  [H2X5-2.54]  29.84,5.71 270 top
J11  [H2-2.54]  16.51,91.44 0 top
J12  [H2-2.54]  19.05,91.44 0 top
J13  [H2-2.54]  21.59,91.44 0 top
J21  [H2-2.54]  16.51,83.82 0 top
J22  [H2-2.54]  19.05,83.82 0 top
J23  [H2-2.54]  21.59,83.82 0 top
J31  [H2-2.54]  16.51,74.6 0 top
J32  [H2-2.54]  19.05,74.6 0 top
J33  [H2-2.54]  21.59,74.6 0 top
J41  [H2-2.54]  16.51,66.98 0 top
J42  [H2-2.54]  19.05,66.98 0 top
J43  [H2-2.54]  21.59,66.98 0 top
J51  [H2-2.54]  16.51,57.76 0 top
J52  [H2-2.54]  19.05,57.76 0 top
J53  [H2-2.54]  21.59,57.76 0 top
J61  [H2-2.54]  16.51,50.14 0 top
J62  [H2-2.54]  19.05,50.14 0 top
J63  [H2-2.54]  21.59,50.14 0 top
K1  JS1-24V-F  [JS-M]  95.73,87.63 0 top
K2  JS1-24V-F  [JS-M]  73.38,87.63 0 top
K3  JS1-24V-F  [JS-M]  95.73,71.25 0 top
K4  JS1-24V-F  [JS-M]  73.38,71.25 0 top
K5  JS1-24V-F  [JS-M]  95.73,54.86 0 top
L2  [MSS1260]  57.4,105.41 0 top
L3  78253/55MVC-R  [IND_78253_MC]  29.46,110.24 90 top
MGT1  MOUNTING_HOLE  [MOUNTING_HOLE]  85.72,123.19 180 top
MGT2  MOUNTING_HOLE  [MOUNTING_HOLE]  38.73,123.19 180 top
MGT3  MOUNTING_HOLE  [MOUNTING_HOLE]  85.72,3.17 180 top
MGT4  MOUNTING_HOLE  [MOUNTING_HOLE]  38.73,3.17 180 top
Q1  MMBT2907  [SOT23-BEC]  61.21,29.97 90 bottom
R1  10K, 1%  [R0402]  75.82,29.59 0 top
R2  1.5K, 1%  [R0402]  13.21,100.46 270 top
R3  10K, 1%  [R0402]  85.17,104.14 0 top
R4  0, 1%  [R0402]  56.92,45.03 90 top
R5  0, 1%  [R0402]  68.33,16.13 180 top
R6  100K, 1%, DNI  [R0402]  65.99,17.98 270 top
R8  1K, 1%  [R0402]  65.99,15.77 90 top
R9  1.5K, 1%  [R0402]  15.75,100.46 270 top
R10  0, 1%  [R0805]  109.73,13.21 180 top
R11  0, 1%  [R0402]  68.33,15.11 180 top
R12  1.5K, 1%  [R0402]  39.67,40.01 180 top
R13  1.5K, 1%  [R0402]  41.91,40.01 0 top
R15  40.2K, 1%  [R0402]  64.52,30.73 180 bottom
R17  1.00K, 1%  [R0805]  72.64,103.89 0 top
R18  4.75K, 1%  [R0402]  67.06,28.32 270 bottom
R19  0, 1%  [R0402]  48.31,21.87 270 bottom
R20  10K, 1%  [R0402]  62.61,32.38 90 bottom
R21  499  [R0402]  61.59,32.38 90 bottom
R22  4.75K, 1%  [R0402]  68.05,28.32 90 bottom
R24  1.5K, 1%  [R0402]  64.26,53.85 90 top
R25  0, 1%  [R0402]  63.75,43.56 90 bottom
R26  1.5K, 1%  [R0402]  115.58,15.88 180 top
R27  100K, 1%  [R0402]  49.81,45.42 90 bottom
R28  0, 1%  [R0402]  40.51,34.04 180 top
R29  0, 1%  [R0402]  40.51,33.02 180 top
R30  0, 1%  [R0402]  40.51,32 180 top
R31  22, 1%  [R0402]  40.51,30.99 180 top
R32  1M, 1%  [R0402]  72.64,25.65 270 top
R33  0, 1%  [R0402]  65.79,43.56 90 bottom
R34  .1, 0805  [R0805]  107.7,121.72 90 top
R35  1.5K, 1%  [R0402]  115.57,13.84 180 top
R36  1.5K, 1%  [R0402]  115.57,11.94 180 top
R37  1.5K, 1%  [R0402]  115.57,10.03 180 top
R38  1.5K, 1%  [R0402]  115.57,8.13 180 top
R39  4.75K, 1%  [R0402]  40.51,27.94 180 top
R40  4.75K, 1%  [R0402]  40.51,29.97 0 top
R41  4.75K, 1%  [R0402]  40.51,28.96 0 top
R42  10K, 1%  [R0402]  58.93,6.99 90 top
R43  10K, 1%  [R0402]  57.91,6.99 90 top
R44  10K, 1%  [R0402]  67.51,10.9 90 top
R45  10K, 1%  [R0402]  68.55,10.9 90 top
R46  10K, 1%  [R0402]  65.23,6.99 90 top
R47  10K, 1%  [R0402]  66.24,6.99 90 top
R48  10K, 1%  [R0402]  66.24,10.9 90 top
R49  10K, 1%  [R0402]  65.23,10.9 90 top
R50  10K, 1%  [R0402]  56.9,6.99 90 top
R51  10K, 1%  [R0402]  55.88,6.99 90 top
R52  10K, 1%  [R0402]  47.29,21.87 90 bottom
R53  100K, 1%  [R0402]  40.08,12.09 0 top
R54  100K, 1%, DNI  [R0402]  40.08,13.08 0 top
R55  100K, 1%  [R0402]  40.08,14.07 0 top
R56  100K, 1%  [R0402]  39.65,10.16 270 top
R57  100K, 1%  [R0402]  38.58,10.16 270 top
R58  100K, 1%  [R0402]  37.52,10.16 270 top
R59  100K, 1%  [R0402]  36.45,10.16 270 top
R60  100K, 1%  [R0402]  35.38,10.16 270 top
R61  100K, 1%  [R0402]  34.32,10.16 270 top
R62  100K, 1%  [R0402]  33.25,10.16 270 top
R63  100K, 1%  [R0402]  32.18,10.16 270 top
R64  100K, 1%, DNI  [R0402]  31.11,10.16 270 top
R65  100K, 1%, DNI  [R0402]  30.05,10.16 270 top
R66  100K, 1%, DNI  [R0402]  28.98,10.16 270 top
R67  100K, 1%  [R0402]  27.91,10.16 270 top
R68  100K, 1%  [R0402]  26.85,10.16 270 top
R69  100, 1%  [R0402]  28.52,15.47 90 top
R70  100K, 1%, DNI  [R0402]  40.21,12.09 0 bottom
R71  100K, 1%  [R0402]  40.21,13.08 0 bottom
R72  100K, 1%, DNI  [R0402]  40.21,14.07 0 bottom
R73  100K, 1%, DNI  [R0402]  39.65,10.29 90 bottom
R74  100K, 1%, DNI  [R0402]  38.58,10.29 90 bottom
R75  100K, 1%, DNI  [R0402]  37.52,10.29 90 bottom
R76  100K, 1%, DNI  [R0402]  36.45,10.29 90 bottom
R77  100K, 1%, DNI  [R0402]  35.38,10.29 90 bottom
R78  100K, 1%, DNI  [R0402]  34.32,10.29 90 bottom
R79  100K, 1%, DNI  [R0402]  33.25,10.29 90 bottom
R80  100K, 1%, DNI  [R0402]  32.18,10.29 90 bottom
R81  100K, 1%  [R0402]  31.11,10.29 90 bottom
R82  100K, 1%  [R0402]  30.05,10.29 90 bottom
R83  100K, 1%  [R0402]  28.98,10.29 90 bottom
R84  100K, 1%, DNI  [R0402]  27.91,10.29 90 bottom
R85  100K, 1%, DNI  [R0402]  26.85,10.29 90 bottom
R86  10K, 1%  [R0402]  3.94,37.72 180 top
R87  10K, 1%  [R0402]  3.94,39.75 180 top
R88  10K, 1%  [R0402]  3.94,40.77 180 top
R89  10K, 1%  [R0402]  3.94,41.78 180 top
R90  10K, 1%  [R0402]  3.94,42.8 180 top
R91  10K, 1%  [R0402]  3.94,38.73 180 top
R92  10K, 1%  [R0402]  19.2,40.39 90 top
R93  3.09K, 1%  [R0805]  72.64,101.83 180 top
R94  100, 5% DNI  [R0805]  72.64,99.75 180 top
R95  1.5K, 1%  [R0402]  67.31,53.85 270 top
R96  1.5K, 1%  [R0402]  66.29,53.85 270 top
R158  100K, 1%  [R0402]  78.87,41.15 180 top
R160  10K, 1%  [R0402]  74.04,41.15 180 top
R161  10K, 1%  [R0402]  76.45,47.73 0 top
R171  10K, 1%  [R0402]  109.22,87.63 180 top
R172  10K, 1%  [R0402]  109.22,80.01 180 top
R173  10K, 1%  [R0402]  109.22,72.39 180 top
R174  10K, 1%  [R0402]  109.22,64.77 180 top
R175  10K, 1%  [R0402]  109.22,57.15 180 top
R181  47V 200A  [CT/CN1206]  12.7,91.44 270 top
R182  47V 200A  [CT/CN1206]  12.7,83.82 270 top
R183  47V 200A  [CT/CN1206]  12.7,74.6 270 top
R184  47V 200A  [CT/CN1206]  12.7,66.98 270 top
R185  47V 200A  [CT/CN1206]  12.7,57.76 270 top
R186  47V 200A  [CT/CN1206]  12.7,50.14 270 top
R211  80, 0.1%  [0309/12]  36.83,90.42 180 top
R212  10K, 1%  [R0805]  26.42,89.41 0 top
R213  2K, 1%  [R0805]  26.42,91.44 0 top
R214  10K, 1%  [R0805]  26.42,93.47 0 top
R221  80, 0.1%  [0309/12]  36.83,82.8 180 top
R222  10K, 1%  [R0805]  26.42,81.79 0 top
R223  2K, 1%  [R0805]  26.42,83.82 0 top
R224  10K, 1%  [R0805]  26.42,85.85 0 top
R231  80, 0.1%  [0309/12]  36.83,73.58 180 top
R232  10K, 1%  [R0805]  26.42,72.57 0 top
R233  2K, 1%  [R0805]  26.42,74.6 0 top
R234  10K, 1%  [R0805]  26.42,76.63 0 top
R241  80, 0.1%  [0309/12]  36.83,65.96 180 top
R242  10K, 1%  [R0805]  26.42,64.95 0 top
R243  2K, 1%  [R0805]  26.42,66.98 0 top
R244  10K, 1%  [R0805]  26.42,69.01 0 top
R251  80, 0.1%  [0309/12]  36.83,56.74 180 top
R252  10K, 1%  [R0805]  26.42,55.73 0 top
R253  2K, 1%  [R0805]  26.42,57.76 0 top
R254  10K, 1%  [R0805]  26.42,59.79 0 top
R261  80, 0.1%  [0309/12]  36.83,49.12 180 top
R262  10K, 1%  [R0805]  26.42,48.11 0 top
R263  2K, 1%  [R0805]  26.42,50.14 0 top
R264  10K, 1%  [R0805]  26.42,52.17 0 top
R281  10K, 1%  [R0402]  3.94,36.7 0 top
R282  10K, 1%  [R0402]  3.94,35.69 0 top
R283  10K, 1%  [R0402]  3.94,34.67 0 top
R284  10K, 1%  [R0402]  3.94,33.66 0 top
R285  10K, 1%  [R0402]  3.94,29.59 0 top
R286  10K, 1%  [R0402]  3.94,30.61 0 top
R287  10K, 1%  [R0402]  3.94,31.62 0 top
R288  10K, 1%  [R0402]  3.94,32.64 0 top
R291  10K, 1%  [R0402]  27.51,15.47 270 top
R292  10K, 1%  [R0402]  26.49,15.47 270 top
R293  10K, 1%  [R0402]  25.48,15.47 270 top
R294  10K, 1%  [R0402]  24.46,15.47 270 top
RTC1  DS3231M  [SO08]  60.71,53.85 0 top
S1  KMR231GLFS  [SW4SMD_63X161LS]  117.47,4.98 180 top
S2  KMR231GLFS  [SW4SMD_63X161LS]  109.86,4.98 180 top
S11  [P101]  5.46,23.24 90 top
S12  [P101]  5.46,12.57 90 top
S13  [DS-04]  16.89,8.51 0 top
TP1  TPB0,65  [TP_B0,65]  57.78,34.54 180 bottom
TP2  TPB0,65  [TP_B0,65]  57.78,33.53 180 bottom
TP3  TPB0,65  [TP_B0,65]  61.85,34.57 180 bottom
TP4  TPB0,65  [TP_B0,65]  62.87,34.57 180 bottom
TP5  TESTPAD/W_HOLE_1X1  [TESTPAD/W_HOLE_1X1]  90.81,6.99 180 top
TP6  TESTPAD/W_HOLE_1X1  [TESTPAD/W_HOLE_1X1]  93.34,6.99 180 top
TP7  TESTPAD/W_HOLE_1X1  [TESTPAD/W_HOLE_1X1]  90.81,4.45 180 top
TP8  TESTPAD/W_HOLE_1X1  [TESTPAD/W_HOLE_1X1]  93.34,4.45 180 top
TP9  TESTPAD/W_HOLE_1X1  [TESTPAD/W_HOLE_1X1]  63.75,48.79 180 top
TP10  TESTPAD/W_HOLE_1X1  [TESTPAD/W_HOLE_1X1]  66.29,48.79 180 top
TP12  TPB0,65  [TP_B0,65]  59.82,34.57 180 bottom
TP13  TPB0,65  [TP_B0,65]  63.88,34.57 180 bottom
TP14  TPB0,65  [TP_B0,65]  72.97,16.59 180 top
TP15  TPB0,65  [TP_B0,65]  63.88,33.02 180 bottom
TP16  TPB0,65  [TP_B0,65]  60.07,32.99 180 bottom
TP21  TPB0,65  [TP_B0,65]  65.05,25.65 180 bottom
TP22  TPB0,65  [TP_B0,65]  56.11,20.32 180 bottom
TP23  TPB0,65  [TP_B0,65]  57.91,28.57 180 bottom
TP24  TPB0,65  [TP_B0,65]  60.83,34.57 180 bottom
TP26  TESTPAD/W_HOLE_1X1  [TESTPAD/W_HOLE_1X1]  68.02,20.47 180 top
TP27  TPB0,65  [TP_B0,65]  72.67,45.09 180 top
TP28  TPB0,65  [TP_B0,65]  72.67,46.35 180 top
TP29  TPB0,65  [TP_B0,65]  80.24,43.81 180 top
TP30  TPB0,65  [TP_B0,65]  80.24,42.55 180 top
U1  OSD3358-512M-BSM  [OSD335X-BGA-256]  61.34,32 270 top
U2  TPD4S012_DRY_6_P1_M  [DRY6]  111.91,10.59 0 bottom
U3  SN74LVC1G07_DCK_5  [DCK5]  71.37,16.51 270 top
U4  APX811SOT  [SOT143-R]  68.07,18.03 270 top
U5  TLVH431  [SOT23-3]  63.88,28.45 0 bottom
U6  SN74LVC2G241_DCU_8  [DCU8]  53.37,45.62 180 bottom
U7  [MICRON_EMMC_153]  48.18,14.81 270 top
U8  LAN8710  [LAN8710A-QFN32]  93.98,28.7 180 top
U16  AT97SC3205T-G3M4400B  [QFN32-0.4-4X4MM]  40.39,43.18 180 top
U21  S25FL127S  [W-PDFN-8]  76.45,44.45 180 top
U25  ISO3086TDW  [DW16]  43.18,109.47 90 top
U26  LP2985A-33DBVR  [DBV5]  35.56,117.35 270 top
U27  TCAN1051HV  [BEAGLEBONE_BLUE_D8]  93.85,43.18 0 top
U$2  [XYZ-LABEL]  48.13,28.32 180 top
U$3  MCP6002SMT  [SOIC8]  47.96,87.66 180 top
U$4  MCP6001  [SOT23-5]  54.61,70.87 0 top
U$5  MCP6002SMT  [SOIC8]  47.96,70.79 180 top
U$6  MCP6002SMT  [SOIC8]  47.93,53.95 180 top
U$8  [OSHW_8MM]  31.11,40.64 0 top
X1  10118192-0001LF  [10118192-0001LF(MICRO-USB-B-AMPHENOL-FCI)]  120.47,10.46 270 bottom
X2  MC2  [MC2]  8.13,100.66 270 top
X3  DM3BT-DSF-PEJS  [DM3BT-DSF-PEJS]  0.25,37.21 90 bottom
X4  J0011D01BNL  [SI-50170]  115.32,29.84 270 top
X7  MSTBA2  [MSTBA2]  116.84,116.05 90 top
X8  MC10  [MC10]  113.77,76.2 90 top
X9  MC4  [MC4]  8.13,87.63 270 top
X10  MC4  [MC4]  8.13,70.79 270 top
X11  MC4  [MC4]  8.13,53.95 270 top
X12  MC3  [MC3]  113.79,48.01 90 top
X13  MSTBA3  [MSTBA3]  5.08,114.1 270 top
Y2  7A-24.000MAAJ-T  [CRYSTAL-TXC-7A]  75.82,25.65 90 top
Y7  7A-25.000MAAE-T  [CRYSTAL-TXC-7A]  93.98,36.37 0 top

## Tracks (layer width: path | path; a pad name or v marks a point on that pad's centre or on a via)
1P8V_REF  (via drill 0.3)
  Top 0.152: U$4.4 55.56,71.18 55.24,70.87 53.98,70.87 53.66,70.55 U$4.1 | U$5.8 51.63,67.64 51.94,67.95 51.94,68.47 52.26,68.78 52.88,68.78 U$4.1 | U$3.8 51.45,84.5 51.94,84.01 51.94,70.65 52.26,70.33 52.89,70.33 U$4.1 | U$6.8 51.63,50.8 51.94,51.11 51.94,66.1 52.26,66.42 53.09,66.42 53.66,67 U$4.1 | v28.73,89.41 R212.2 | v28.73,81.79 R222.2 | v28.73,72.57 R232.2 | v28.73,64.95 R242.2 | v28.73,55.73 R252.2 | v28.73,48.11 R262.2 | U$3.8 49.86,88.01 49.23,88.65 v43.18,88.65 | v43.18,81.03 49.23,81.03 49.86,81.66 U$3.8 | v43.18,47.35 49.2,47.35 49.84,47.98 U$6.8 | v43.18,54.97 49.2,54.97 49.84,54.33 U$6.8 | v43.16,64.16 49.23,64.16 49.86,64.8 U$5.8 | v43.18,71.78 49.23,71.78 49.86,71.14 U$5.8 | U$4.1
  Bottom 0.152: v28.73,48.11 29.49,47.35 v43.18,47.35 | v43.18,54.97 29.49,54.97 v28.73,55.73 | v43.16,64.16 29.52,64.16 v28.73,64.95 | v43.18,71.78 29.52,71.78 v28.73,72.57 | v43.18,81.03 29.49,81.03 v28.73,81.79 | v43.18,88.65 29.49,88.65 v28.73,89.41
5V_OUT
  pour Top: 56.98,117.2 53.07,117.2 52.76,116.88 52.76,107.18 53.07,106.86 60.39,106.86 60.71,106.54 60.71,105.13 60.76,105.08 61.01,104.83 70.4,104.83 70.56,104.99 70.56,111.06 70.24,111.38 69.48,111.38 69.16,111.06 69.16,107.1 68.85,106.78 63.72,106.78 63.4,107.1 63.4,112.51 63.08,112.83 57.62,112.83 57.3,113.14 57.3,116.88
24VAC
  pour Top: 105.26,108.52 105.26,105.73 104.94,105.41 97.4,105.41 97.08,105.73 97.08,108.52 97.4,108.84 104.94,108.84
24VAC_IN
  pour Top: 105.83,108.51 105.84,105.73 106.16,105.41 113.98,105.41 114.3,105.73 114.3,115.28 113.98,115.6 108.96,115.6 108.64,115.28 108.65,109.14 108.33,108.83 106.15,108.83
24VAC_UNREG  (via drill 0.3)
  other vias: 67.06,110.49 67.06,109.73 67.06,108.97 67.06,108.2 67.82,108.2 68.58,108.2 97.92,113.54 98.68,113.54 99.44,113.54 100.2,113.54 97.92,112.78 98.68,112.78 99.44,112.78 100.2,112.78
  pour Top: 101.04,117.67 101.04,109.88 100.72,109.56 97.4,109.56 97.08,109.88 97.08,117.67 97.4,117.98 100.72,117.98
  pour Bottom: 100.72,117.98 78.19,117.98 77.88,117.67 77.88,112.65 77.56,112.33 65.72,112.33 65.41,112.01 65.41,105.14 65.72,104.83 93.28,104.83 93.6,105.14 93.6,109.25 93.92,109.56 100.72,109.56 101.04,109.88 101.04,117.67
  pour Top: 64.12,107.19 68.54,107.19 68.86,107.51 68.86,111.07 68.54,111.39 65.75,111.39 65.41,111.73 65.41,116.14 65.09,116.46 61.35,116.46 61.04,116.14 61.04,113.53 61.35,113.21 63.49,113.21 63.8,112.89 63.8,107.51
24VDC_AUX
  Top 0.152: D2.1 88.27,102.11
  Top 0.305: K2.1 87.76,93.63 88.39,93 88.39,92.58 89.03,91.95 91.31,91.95 91.95,92.58 91.95,93 92.58,93.63 K1.1 109.84,93.63 110.48,93 D21.1 D22.1 110.48,77.72 | 110.48,77.72 D23.1 D24.1 110.48,62.56 | IC2.9 80.14,55.27 80.77,54.63 99.19,54.63 99.82,55.27 99.82,60.23 100.46,60.86 K5.1 102.43,61.92 103.07,62.56 110.48,62.56 | 110.48,62.56 D25.1 | K4.1 87.76,77.25 88.39,76.61 88.39,76.25 89.03,75.62 91.31,75.62 91.95,76.25 91.95,76.61 92.58,77.25 K3.1 107.07,77.25 107.54,77.72 110.48,77.72
  Top 0.813: IC3.OUT 88.27,102.11 88.27,98.35 87.63,97.71 80.72,97.71 80.08,97.08 K2.1 | X2.1 X2.2
  Bottom 0.813: X2.1 19.56,102.56 20.19,101.93 20.19,100.64 21.01,99.82 29.52,99.82 30.15,99.19 30.15,98.17 30.61,97.71 87.63,97.71 88.27,98.35 IC3.OUT
AGND  (via drill 0.3)
  Top 0.152: 61.95,41.55 U1.A9 | R211.1 43.18,92.84 42.55,93.47 C111.2 29.34,91.44 R213.2 | R223.2 29.34,83.82 C121.2 42.55,85.85 43.18,85.22 R221.1 | R233.2 29.34,74.6 C131.2 42.55,76.63 43.18,76 R231.1 | R243.2 29.34,66.98 C141.2 42.55,69.01 43.18,68.38 R241.1 | R253.2 29.34,57.76 C151.2 42.55,59.79 43.18,59.16 R251.1 | R263.2 29.34,50.14 C161.2 42.55,52.17 43.18,51.54 R261.1 | U$3.4 | 46.02,57.11 U$6.4 | 46.05,73.95 U$5.4
  Top 0.254: v46.05,92.43 U$3.4 | v46.02,58.73 46.02,57.11 | v46.05,75.56 46.05,73.95 | v54.61,68.45 U$4.2
  Bottom 0.152: C8.2 C9.2 66.8,43.74 66.62,43.56 64.92,43.56 64.77,43.41 C10.2 64.39,43 64.26,43.13 64.26,43.97 64.11,44.12 R25.2 v62.69,44.12
  other vias: 61.26,42.95 61.26,44.12
  pour Top: 62.26,41.25 61.8,41.25 61.52,41.53 61.39,41.53 60.78,42.14 60.78,44.25 61.06,44.53 62.89,44.53 63.14,44.27 63.14,43.76 62.89,43.51 62.38,43.51 62.26,43.38
  pour Route2: 2.21,47.02 2.59,46.63 54.99,46.63 59.31,42.32 61.67,42.32 62.31,42.95 62.31,43.22 62.62,43.54 62.95,43.54 63.27,43.85 63.27,47.65 62.18,48.74 60.68,48.74 60.22,49.2 60.22,53.92 59.59,54.56 57.05,54.56 56.41,55.19 56.41,94.72 55.78,95.35 2.84,95.35 2.21,94.72
AIN0  (via drill 0.3)
  Top 0.152: v59.92,47.7 59.92,44.68 60.35,44.25 60.35,42.22 60.71,41.86 U1.A8
AIN1  (via drill 0.3)
  Top 0.152: U$3.1 U$3.2 v48.59,92.43 | v60.1,39.88 60.33,39.88 U1.B8
  Bottom 0.152: v48.59,92.43 48.59,92.84 47.95,93.47 44.68,93.47 44.04,92.84 44.04,43.36 45.72,41.68 53.11,41.68 55.17,39.62 59.84,39.62 v60.1,39.88
AIN2  (via drill 0.3)
  Top 0.152: U$3.7 U$3.6 v47.32,86.13 | U1.B6 58.17,40.54 v57.84,40.87
  Bottom 0.152: v57.84,40.87 57.3,40.34 56.03,40.34 54.38,41.99 45.85,41.99 44.35,43.49 44.35,86.08 44.98,86.72 46.74,86.72 v47.32,86.13
AIN3  (via drill 0.3)
  Top 0.152: U$5.1 U$5.2 48.59,73.95 v48.59,75.56 | U1.C6 57.53,39.62 56.67,39.62 56.26,40.03 56.26,40.59 v56.57,40.89
  Bottom 0.152: v56.57,40.89 55.17,42.29 45.98,42.29 44.65,43.62 44.65,76 45.29,76.63 47.95,76.63 48.59,76 v48.59,75.56
AIN4  (via drill 0.3)
  Top 0.152: U$5.7 U$5.6 v47.32,69.27 | U1.C7 58.65,39.78 58.65,40.99 v58.8,41.15
  Bottom 0.152: v58.8,41.15 57.35,42.6 46.1,42.6 44.96,43.74 44.96,69.24 45.59,69.88 46.71,69.88 v47.32,69.27
AIN5  (via drill 0.3)
  Top 0.152: U$6.1 U$6.2 48.56,57.11 v48.56,58.73 | U1.C8 60.38,39.32 59.83,39.32 59.52,39.63 59.24,39.63 58.96,39.91 58.96,40.51 59.39,40.95 59.84,40.95 v60.07,41.17
  Bottom 0.152: v60.07,41.17 58.34,42.9 46.23,42.9 45.26,43.87 45.26,59.13 45.9,59.77 47.93,59.77 48.56,59.13 v48.56,58.73
AIN6  (via drill 0.3)
  Top 0.152: U$6.7 U$6.6 v47.3,52.43 | v62.61,40.59 62.61,40.03 61.98,39.4 U1.C9
  Bottom 0.152: v47.3,52.43 46.69,53.03 46.2,53.03 45.57,52.4 45.57,43.99 46.36,43.2 59.28,43.2 60.71,41.78 60.71,40.84 60.96,40.59 v62.61,40.59
AIN7
  Top 0.152: U1.D6 U1.D7
B03_NO
  Bottom 1.524: X8.6 107.09,78.11 103.91,74.93 91.23,74.93 90.23,75.93 K3.NO
B_UART0_RX  (via drill 0.3)
  Top 0.152: J3.4 18.29,96.55 18.92,95.91 56.47,95.91 57.28,95.1 57.28,57.3 v57.63,56.95
  Bottom 0.152: R27.2 50.42,45.97 51.02,45.37 U6.2 53.06,45.37 53.7,46 53.7,47.65 54.1,48.06 57,48.06 57.63,48.69 v57.63,56.95
B_UART0_TX  (via drill 0.3)
  Top 0.152: J3.5 15.75,96.24 16.38,95.61 56.34,95.61 56.97,94.97 v56.97,56.39
  Bottom 0.152: U6.3 52.83,45.87 53.11,46.15 53.11,47.95 53.75,48.59 56.62,48.59 56.97,48.95 v56.97,56.39
BAT_SENSE
  Top 0.152: U1.N7 60.22,25.5 60.22,14.35 60.53,14.05 69.29,14.05 69.77,13.56 69.77,9.3 70.43,8.64 92.71,8.64 93.34,8 TP6.P$1
BO1_C
  Bottom 1.524: X8.9 106.34,89.53 K1.C
BO1_NO
  Bottom 1.524: X8.10 105.87,93.34 103.71,91.19 91.23,91.19 90.23,92.19 K1.NO
BO2_C
  Bottom 1.524: X8.7 106.22,81.92 103.76,79.45 98.54,79.45 97.54,80.45 97.54,83.18 96.54,84.18 83.08,84.18 82.08,85.18 K2.C
BO2_NO
  Bottom 1.524: X8.8 107.04,85.72 105.87,84.56 102.6,84.56 101.6,85.56 101.6,86.68 100.6,87.68 89.14,87.68 88.14,88.68 88.14,89.6 87.14,90.6 68.88,90.6 67.88,91.6 K2.NO
BO3_C
  Bottom 1.524: X8.5 107.48,74.3 K3.C
BO4_C
  Bottom 1.524: X8.3 108.48,66.67 106.73,64.92 105.77,64.92 103.83,62.99 98.54,62.99 97.54,63.99 97.54,66.82 96.54,67.82 83.08,67.82 82.08,68.82 K4.C
BO4_NO
  Bottom 1.524: X8.4 107.9,70.48 105.54,68.12 102.6,68.12 101.6,69.12 101.6,70.25 100.6,71.25 89.14,71.25 88.14,72.25 88.14,73.37 87.14,74.37 68.88,74.37 67.88,75.37 K4.NO
BO5_C
  Bottom 1.524: X8.1 111.18,59.05 108.99,56.87 106.44,56.87 K5.C
BO5_NO
  Bottom 1.524: X8.2 109.8,62.87 107.57,60.63 106.32,60.63 104.09,58.4 91.23,58.4 90.23,59.4 K5.NO
CGND
  Top 0.508: R184.2 12.7,63.8 12.06,63.17 0.64,63.17 | R183.2 12.7,71.42 12.06,70.79 0.64,70.79 | R181.2 12.7,88.27 12.06,87.63 0.64,87.63 | R182.2 12.7,80.64 12.06,80.01 0.64,80.01 | R185.2 12.7,54.59 12.06,53.95 0.64,53.95 | R186.2 12.7,46.97 12.06,46.33 0.64,46.33
  Top 0.61: 116.99,44.2 X12.1 112.01,42.42 D11.A 109.99,40.93 109.44,40.38 D10.A
  Bottom 0.152: X3.CGND3 0.5,30.96 X3.CGND1
  Bottom 0.813: X3.CGND4 16.18,32.13 15.24,32.13 14.73,32.64 14.73,33.53 11.68,36.58 1.02,36.58 | X3.CGND5 12,42.61 11.56,42.16 1.78,42.16
  pour Top: 121.41,29.84 127,29.84 127,132.08 -5.08,132.08 -5.08,29.84 1.27,29.84 1.27,120.02 6.99,120.02 8.89,121.92 8.89,125.09 9.53,125.73 34.92,125.73 35.56,125.09 35.56,121.41 36.96,120.02 40.51,120.02 41.91,121.41 41.91,125.09 42.55,125.73 79.88,125.73 80.52,125.09 80.52,119.81 81.79,118.54 89.66,118.54 90.93,119.81 90.93,125.09 91.57,125.73 105.41,125.73 106.05,125.09 106.05,122.56 106.68,121.92 116.2,121.92 116.84,121.28 116.84,40.26 116.2,39.62 111.51,39.62 110.24,38.35 110.24,37.08 111.51,35.81 112.78,35.81 114.3,37.59 120.78,37.59 121.41,36.96
  pour Bottom (rank 6): 123.19,29.84 121.49,29.84 121.41,29.77 121.41,22.73 120.78,22.1 115.82,22.1 115.19,21.46 115.19,14.35 116.84,12.7 118.87,12.7 118.87,8.26 116.84,8.26 115.57,6.99 115.57,1.91 114.94,1.27 89.53,1.27 88.9,1.91 88.9,5.08 87.63,6.35 83.82,6.35 82.55,5.08 82.55,1.91 81.92,1.27 42.29,1.27 41.66,1.91 41.66,5.08 40.39,6.35 37.08,6.35 35.81,5.08 35.81,1.91 35.18,1.27 9.53,1.27 8.89,1.91 8.89,5.08 6.99,6.99 1.27,6.99 1.27,27.94 1.91,28.57 1.91,29.84 -1.27,29.84 -1.27,-1.27 123.19,-1.27
  pour Bottom (rank 6): 81.79,118.54 89.66,118.54 90.93,119.81 90.93,125.09 91.57,125.73 116.2,125.73 116.84,125.09 116.84,38.23 117.47,37.59 120.78,37.59 121.41,36.96 121.41,29.84 123.19,29.84 123.19,128.27 -1.27,128.27 -1.27,29.84 1.91,29.84 1.91,41.4 2.41,41.91 4.19,41.91 4.83,42.55 4.83,44.32 4.19,44.96 2.29,44.96 1.91,45.34 1.91,120.02 6.99,120.02 8.89,121.92 8.89,125.09 9.53,125.73 34.92,125.73 35.56,125.09 35.56,121.41 36.96,120.02 40.51,120.02 41.91,121.41 41.91,125.09 42.55,125.73 79.88,125.73 80.52,125.09 80.52,119.81
  pour Top: 127,29.84 121.41,29.84 121.41,22.73 120.78,22.1 114.3,22.1 112.78,23.88 111.51,23.88 110.24,22.61 110.24,21.34 111.51,20.07 120.02,20.07 120.65,19.43 120.65,1.91 120.02,1.27 89.53,1.27 88.9,1.91 88.9,5.08 87.63,6.35 83.82,6.35 82.55,5.08 82.55,1.91 81.92,1.27 42.29,1.27 41.66,1.91 41.66,5.08 40.39,6.35 37.08,6.35 35.81,5.08 35.81,1.91 35.18,1.27 9.53,1.27 8.89,1.91 8.89,5.08 6.99,6.99 1.27,6.99 1.27,29.84 -5.08,29.84 -5.08,-5.08 127,-5.08
CLKOUT2
  Top 0.152: J4.18 32.49,19.68 31.8,20.37 27.55,20.37 27.05,20.87 27.05,30.53 27.58,31.06 35.74,31.06 36.37,31.7 36.37,34.98 37.67,36.27 43.26,36.27 46.76,39.78 48.92,39.78 49.43,40.28 49.43,42.32 50.01,42.9 53.88,42.9 54.95,43.97 C2.2 54.94,44.18 54.94,41.43 55.63,40.74 U1.B4
CRS
  Top 0.152: U8.14 86.38,27.95 ER124.1
EEPROM_WP  (via drill 0.3)
  Top 0.152: U1.M2 53.49,27.96 v53.67,27.96
  Bottom 0.152: J1.1 71.42,10.79 71.02,11.2 71.02,12.75 70.38,13.39 64.54,13.39 56.79,21.13 56.79,21.74 53.67,24.87 v53.67,27.96
EHRPWM2A  (via drill 0.3)
  Top 0.152: U1.T4 55.63,21.79 55.45,21.61 55.45,21.06 58.4,18.11 58.4,10.05 58.71,9.73 60.36,9.73 60.68,9.41 v60.68,5.51
EHRPWM2B  (via drill 0.3)
  Top 0.152: v62.97,5.51 62.97,10.32 62.65,10.64 59.63,10.64 59.31,10.96 59.31,19.91 57.38,21.84 57.38,23.94 56.9,24.43 U1.P5
EMMC_RSTN  (via drill 0.3)
  Top 0.152: U7.K5 46.93,16.07 47.45,16.59 v47.45,19.56
  Bottom 0.152: R52.1 R19.2 48.31,20.42 v47.45,19.56
EMMC_VCCI  (via drill 0.3)
  Top 0.152: v50.16,18.75 50.43,18.48 U7.C2
  Bottom 0.152: C13.2 50.14,18.77 v50.16,18.75
GND  (via drill 0.3, 0.3 pad 0.61, 0.3 pad 0.76, 0.5)
  Top 0.152: R158.2 v78.31,41.86 | U16.9 41.96,45.08 42.24,45.36 v42.24,45.54 | U16.24 38,41.78 v37.82,41.96 38.04,42.18 U16.23 | U16.18 37.98,44.18 v37.8,43.99 38.01,43.78 U16.19 | U16.20 37.99,43.38 v37.8,43.18 37.99,42.98 U16.21 | U16.5 42.77,43.38 v42.98,43.59 42.78,43.78 U16.6 | U7.N5 U7.P4 44.22,17.27 v44.22,17.8 | v48.18,14.81 48.18,15.81 U7.G5 48.43,16.28 48.69,16.54 49.45,16.54 49.78,16.2 50.08,16.2 U7.C4 | v48.18,14.81 49.18,14.81 U7.E7 | U7.H10 48.18,13.81 v48.18,14.81 | U7.K8 47.18,14.81 v48.18,14.81 | U7.N2 45.43,18.23 v45.92,18.72 | U7.P6 44.61,15.56 v44.32,15.85 | S1.2 114.47,5.78 v114.45,5.77 | S2.3 112.97,4.18 v112.98,4.19 | R6.1 66.34,18.54 66.59,18.78 U4.1 67.91,18.78 v68.17,18.52 | U16.32 41.79,40.97 42.04,40.72 v42.32,40.72 | U3.3 70.74,17.57 v70.74,18.67 | 27.89,10.74 R67.1 | ER102.2 88.62,34.09 | 88.62,35.15 ER104.2 | ER128.1 EC39.2 | 99.26,23.93 99.31,23.98 | 99.19,30.02 EC40.2 | 41.27,102.95 C42.2 | v15.75,99.06 R9.2 | v13.21,99.06 R2.2 | v80.14,52.7 IC2.8 | v13.08,20.65 13.72,20.65 14.35,21.29 IC5.15 | v11.02,33.27 12.37,31.93 14.15,31.93 14.35,32.13 IC4.15 | C85.2 v37.08,39.22 | U16.2 42.86,42.18 v43,42.04 | IC3.GND R3.2 | IC5.3 IC5.4 IC5.5 IC5.6 19.43,18.22 19.75,18.54 21.65,18.54 21.97,18.22 IC5.8 | U8.33 v95.1,28.7
  Top 0.254: S1.4 S1.2 | S2.3 S2.1 | R37.2 v114.2,10.03 | R38.2 v114.2,8.13 | R35.2 v114.2,13.84 | R36.2 v114.2,11.94 | R26.2 v114.2,15.88 | R59.1 R58.1 R57.1 R56.1 v40.36,10.72 | R65.1 R64.1 R63.1 R62.1 R61.1 R60.1 v35.38,11.61 | R66.1 R67.1 R68.1 | R55.1 40.23,14.78 v40.66,14.78 | R54.1 R53.1 v38.73,12.09 | J4.10 v32.51,24.77 | v32.51,28.57 J4.4 | v65.28,55.24 C97.2 | v27.89,11.61 27.89,10.74 | R294.1 R293.1 R292.1 R291.1 | v89.41,29.01 ER101.2 | v84.38,30.02 EC34.2 | ER103.2 89.1,33.6 | 89.1,33.6 v89.41,33.6 | 88.62,34.09 89.1,33.6 | v98.48,25.96 EC38.2 EC37.2 99.31,23.98 EC36.2 ER117.1 | EC42.2 v91.19,39.37 | EC41.2 v96.77,39.37 | v84.38,24.94 ER129.2 | v89.41,35.15 88.62,35.15 | EC35.2 EC33.2 v90.65,34.09 | EC30.2 EC31.2 v97.31,34.09 | EC39.2 v101.27,35.1 | v77.22,29.59 R1.2 | v98.48,23.93 99.26,23.93 | v98.68,29.52 99.19,30.02 | v98.48,37.13 ER115.1 ER120.1 | U25.3 41.27,102.95 | v41.43,102.01 C42.2 | v75.16,108.2 IC1.5 | v32.59,20.95 J4.16 | v32.51,26.04 J4.8 | v32.51,23.5 J4.12 | v32.31,18.41 J4.20 | v50.77,44.86 51.44,44.2 C2.1 C1.1 | v42.04,27.94 R39.1 C14.2 C15.2 | C19.1 C18.1 C20.1 v58.7,3.89
  Top 0.305: C93.2 v75.89,41.86 | 110.62,15.49 C3.2 110.85,15.49 v111.07,15.27 | U21.4 v80.24,46.35 | C16.1 v57.15,12.27 | C21.2 12.57,39.5 v14.1,39.5 | R281.1 R282.1 R283.1 | R283.1 R284.1 R288.1 R287.1 R286.1 R285.1 | v2.41,34.67 R283.1 | IC5.8 v21.97,15.49 | v24.46,16.94 R294.1 | v21.97,25.65 IC4.8 | v89.92,43.81 U27.2
  Top 0.381: C22.2 v4.5,45.59 | C87.2 C88.2 C79.2 v22.25,38.99
  Top 0.406: v80.92,16.2 79.73,17.4 C11.-
  Bottom 0.152: v48.18,14.81 47.19,14.81 46.86,14.48 C17.1 | R18.1 67.06,29.23 66.83,29.46 v66.29,29.46 | U2.4 111.5,10.13 v110.8,10.13 | v50.14,23.32 C13.1
  Bottom 0.254: U6.1 50.79,44.87 v50.77,44.86 R27.1 C6.1 | C6.1 v47.75,45.97 | v93.98,29.97 93.98,33.55 | 93.98,33.55 94.51,34.09 v97.31,34.09 | v90.65,34.09 93.45,34.09 93.98,33.55 | v93.98,27.43 93.98,26.16 98.09,22.05 v98.09,21.18 | C6.1 49.33,46.61 50.32,46.61 50.56,46.37 U6.4
  Bottom 0.305: X3.6 16.19,39.5 v14.1,39.5 | X3.GND 5.85,43.56 v6.73,43.56
  other vias: 95.1,27.43 92.86,27.43 92.86,28.7 95.1,29.97 92.86,29.97 66.29,27.05 61.34,26.92 58.8,27.05 56.41,27.08 66.29,34.54 66.29,36.96 63.88,36.96 58.8,36.96 56.39,36.96 56.39,34.54 56.26,32 56.39,29.46 112.9,9.02 61.34,36.96 98.09,20.47 26.42,102.49 26.42,101.73 70.74,114.55 71.75,114.55 68.71,114.55 69.72,114.55 68.71,115.57 69.72,115.57 70.74,115.57 71.75,115.57 72.77,115.57 73.79,115.57 72.77,114.55 73.79,114.55 74.8,115.57 74.8,114.55 68.71,116.59 69.72,116.59 70.74,116.59 71.75,116.59 72.77,116.59 73.79,116.59 74.8,116.59 74.8,117.6 68.71,117.6 69.72,117.6 70.74,117.6 71.75,117.6 72.77,117.6 73.79,117.6 74.8,118.62 72.77,118.62 73.79,118.62 70.74,118.62 71.75,118.62 68.71,118.62 69.72,118.62 74.8,119.63 74.8,120.65 72.77,120.65 73.79,120.65 72.77,119.63 73.79,119.63 70.74,120.65 71.75,120.65 70.74,119.63 71.75,119.63 68.71,119.63 69.72,119.63 68.71,120.65 69.72,120.65 68.35,103.76 69.11,103.76 112.14,9.02 112.14,8.26 112.9,8.26
  pour Route2 (rank 2): 125.73,-3.81 -3.81,-3.81 -3.81,130.81 125.73,130.81
  pour Top (rank 6): 66.42,37.08 62.61,37.08 62.61,37.72 60.07,37.72 60.07,37.08 56.26,37.08 56.26,33.27 55.63,33.27 55.63,30.73 56.26,30.73 56.26,26.92 60.07,26.92 60.07,26.29 62.61,26.29 62.61,26.92 66.42,26.92 66.42,30.73 67.06,30.73 67.06,33.27 65.79,33.27 65.79,27.56 56.9,27.56 56.9,36.45 65.79,36.45 65.79,33.91 66.42,33.91
  pour Top (rank 6): 66.42,33.91 66.42,33.27 65.79,33.27 65.79,33.91
  pour Top: 98.5,19.81 98.5,21.84 96.65,21.84 96.65,19.81
  pour Top: 28.07,101.19 26.06,101.19 25.81,101.45 25.81,102.77 26.06,103.02 28.07,103.02 28.32,102.77 28.32,101.45
  pour Top: 106.15,120.99 106.15,117.16 106.46,116.84 113.98,116.84 114.3,117.16 114.3,120 113.98,120.32 109.54,120.32 109.22,120.64 109.22,120.99 108.9,121.31 106.46,121.31
  pour Top: 60.96,117.47 60.96,119.21 60.64,119.53 53.07,119.53 52.76,119.85 52.76,123.99 53.07,124.31 77.56,124.31 77.88,123.99 77.88,112.64 77.56,112.32 72.56,112.32 72.24,112 72.24,103.3 71.92,102.98 71.18,102.98 70.87,103.3 70.87,112 70.55,112.32 66.09,112.32 65.77,112.64 65.77,116.88 65.46,117.2 61.24,117.2
  pour Top: 69.68,104.44 68.08,104.44 67.77,104.13 67.77,101.05 68.08,100.74 69.68,100.74 70,101.05 70,104.13
  pour Bottom (no thermals): 118.49,9.32 118.49,8.76 116.33,8.76 116.2,8.64 113.79,8.64 113.56,8.41 113.56,7.72 111.63,7.72 111.63,9.32
GPIO0_18  (via drill 0.3)
  Top 0.152: RTC1.3 61.34,50.23 61.66,49.91 v62.23,49.91 | v68.68,32 69.32,31.37 U1.J15
  Bottom 0.152: v62.23,49.91 68.36,49.91 69.04,49.24 69.04,43.46 70.94,41.55 70.94,34.26 v68.68,32 | v68.68,32
GPIO0_26  (via drill 0.3)
  Top 0.152: v61.44,5.51 61.44,9.72 61.12,10.03 59.02,10.03 58.7,10.35 58.7,19.66 56.41,21.95 56.41,22.71 56.9,23.19 U1.R5
GPIO0_27  (via drill 0.3)
  Top 0.152: U1.T5 56.9,21.89 59,19.79 59,10.65 59.32,10.34 61.89,10.34 62.2,10.02 v62.2,5.51
GPIO1_12  (via drill 0.3)
  Top 0.152: v59.05,23.09 58.78,23.37 58.78,24.41 U1.P6 | v72.52,52.7 IC2.2
  Bottom 0.152: v59.05,23.09 59.84,22.3 66.53,22.3 67.08,22.86 67.08,24.89 68.81,26.62 70.89,26.62 71.86,27.59 71.86,41.94 69.95,43.84 69.95,48.74 71.4,50.19 71.88,50.19 72.52,50.83 v72.52,52.7
GPIO1_13  (via drill 0.3)
  Top 0.152: U1.R6 58.17,23.93 v57.56,24.54 | v73.79,52.7 IC2.3